# EAGLE board haasoscope_pro_fpga_board - power and fanout (EAGLE 9.6.2)
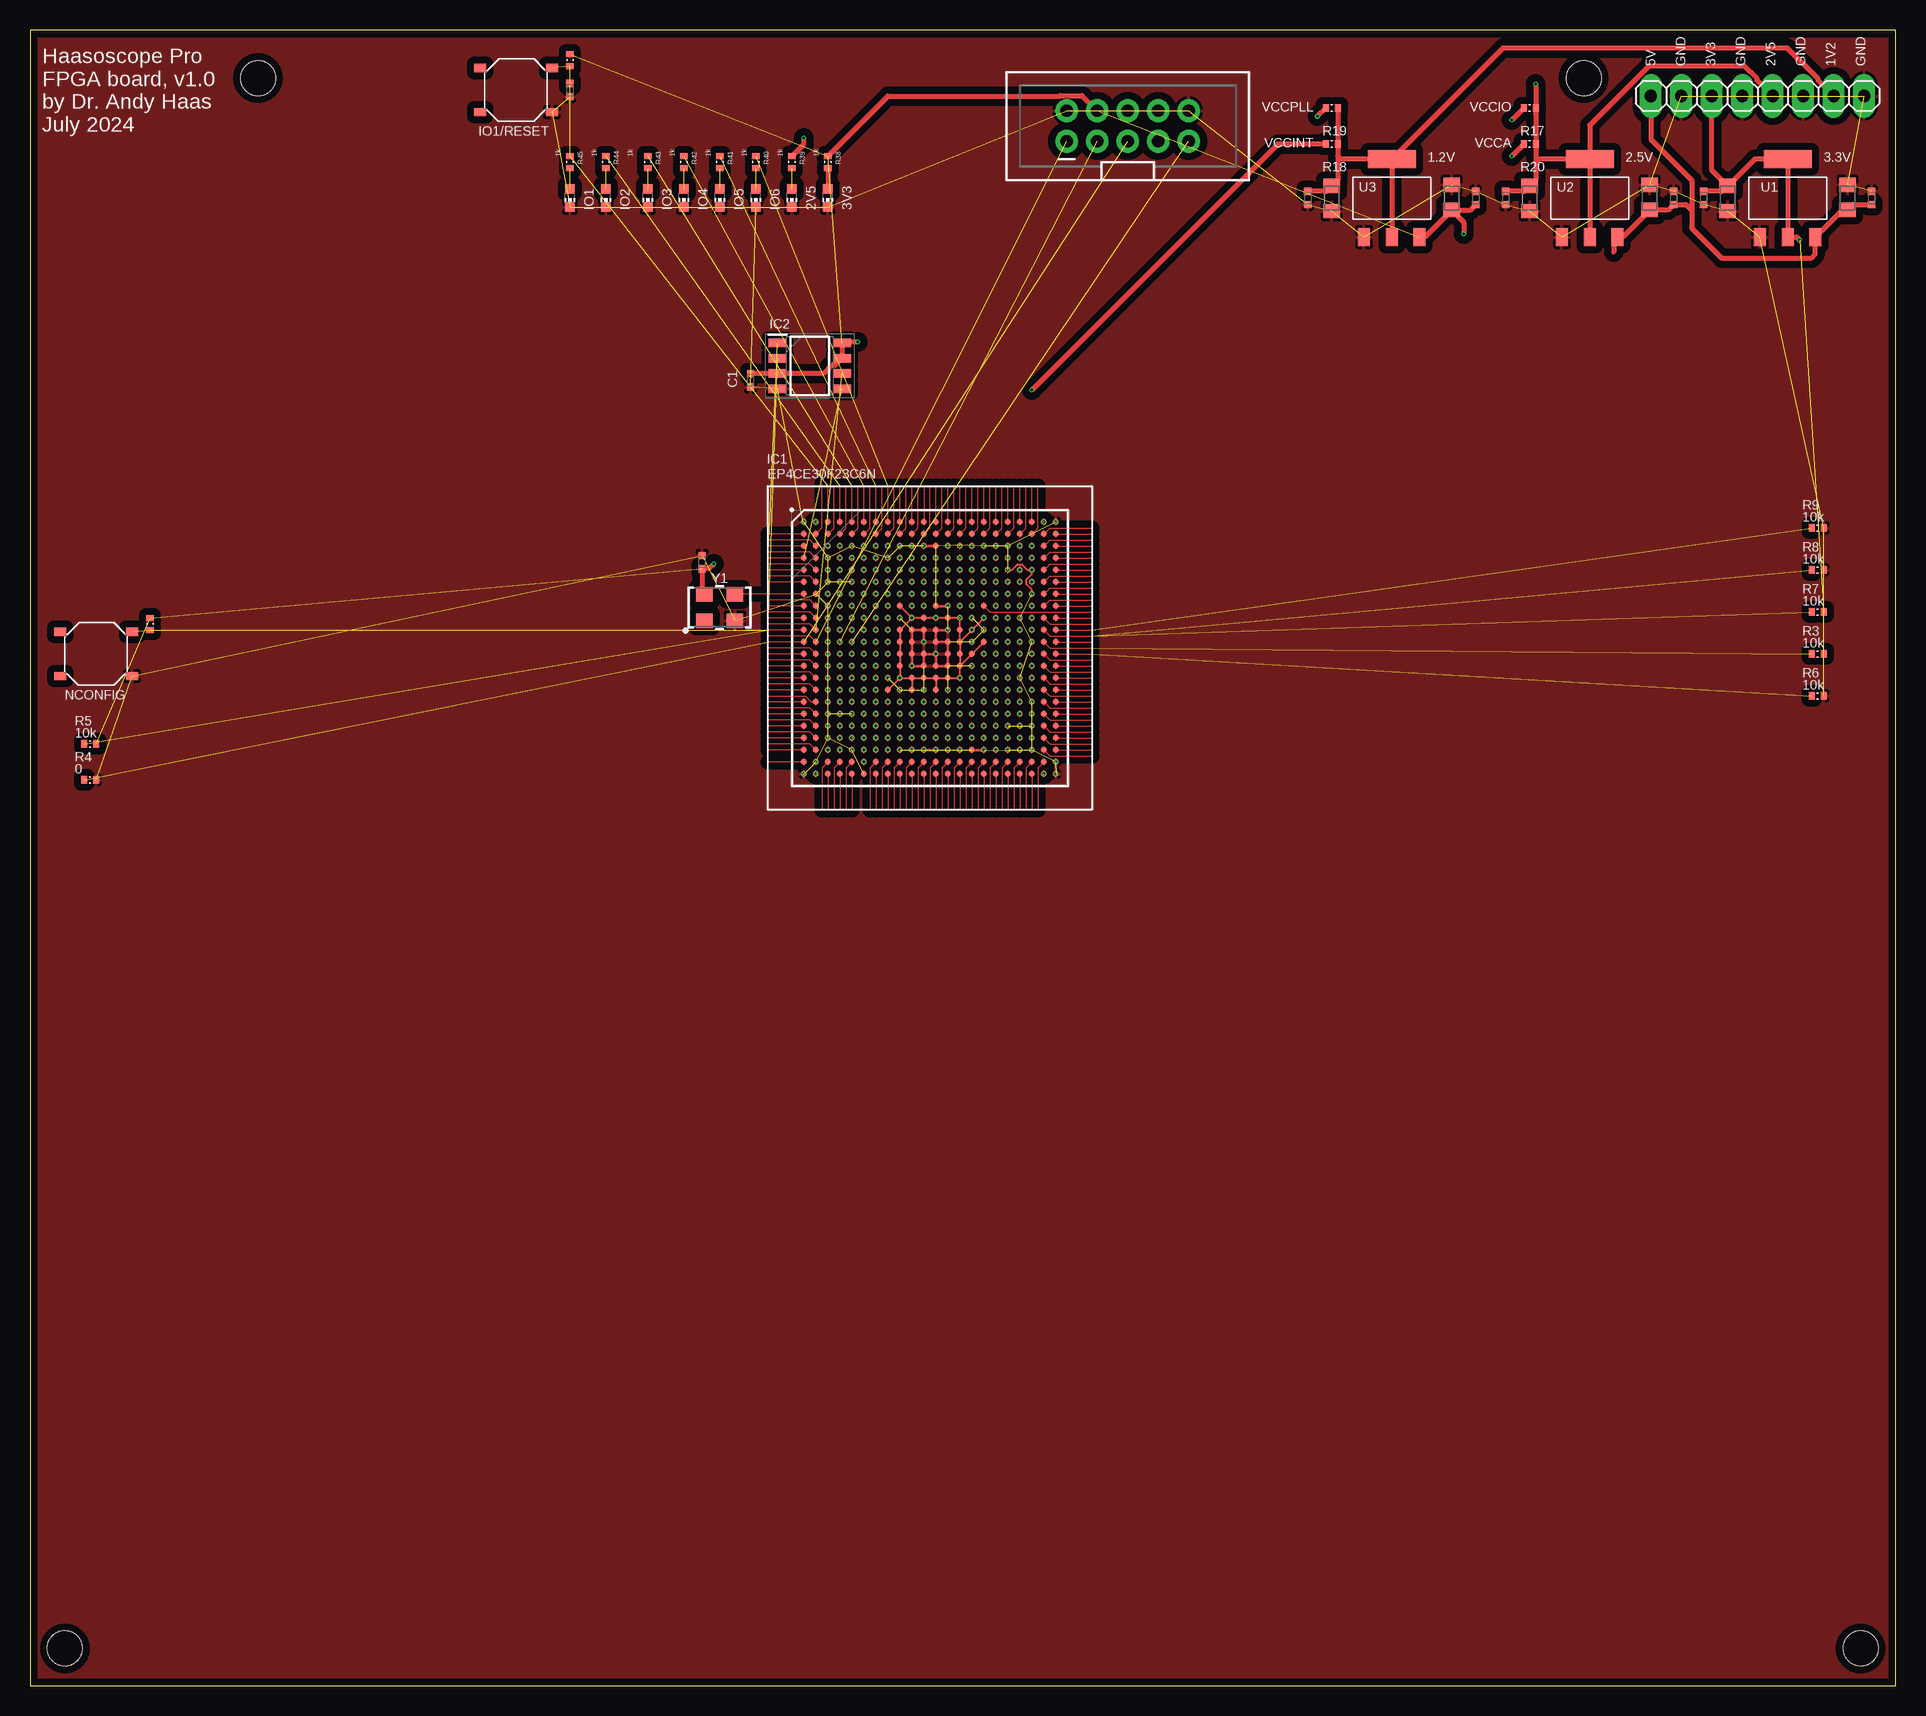
[diagram p4: board, top side]
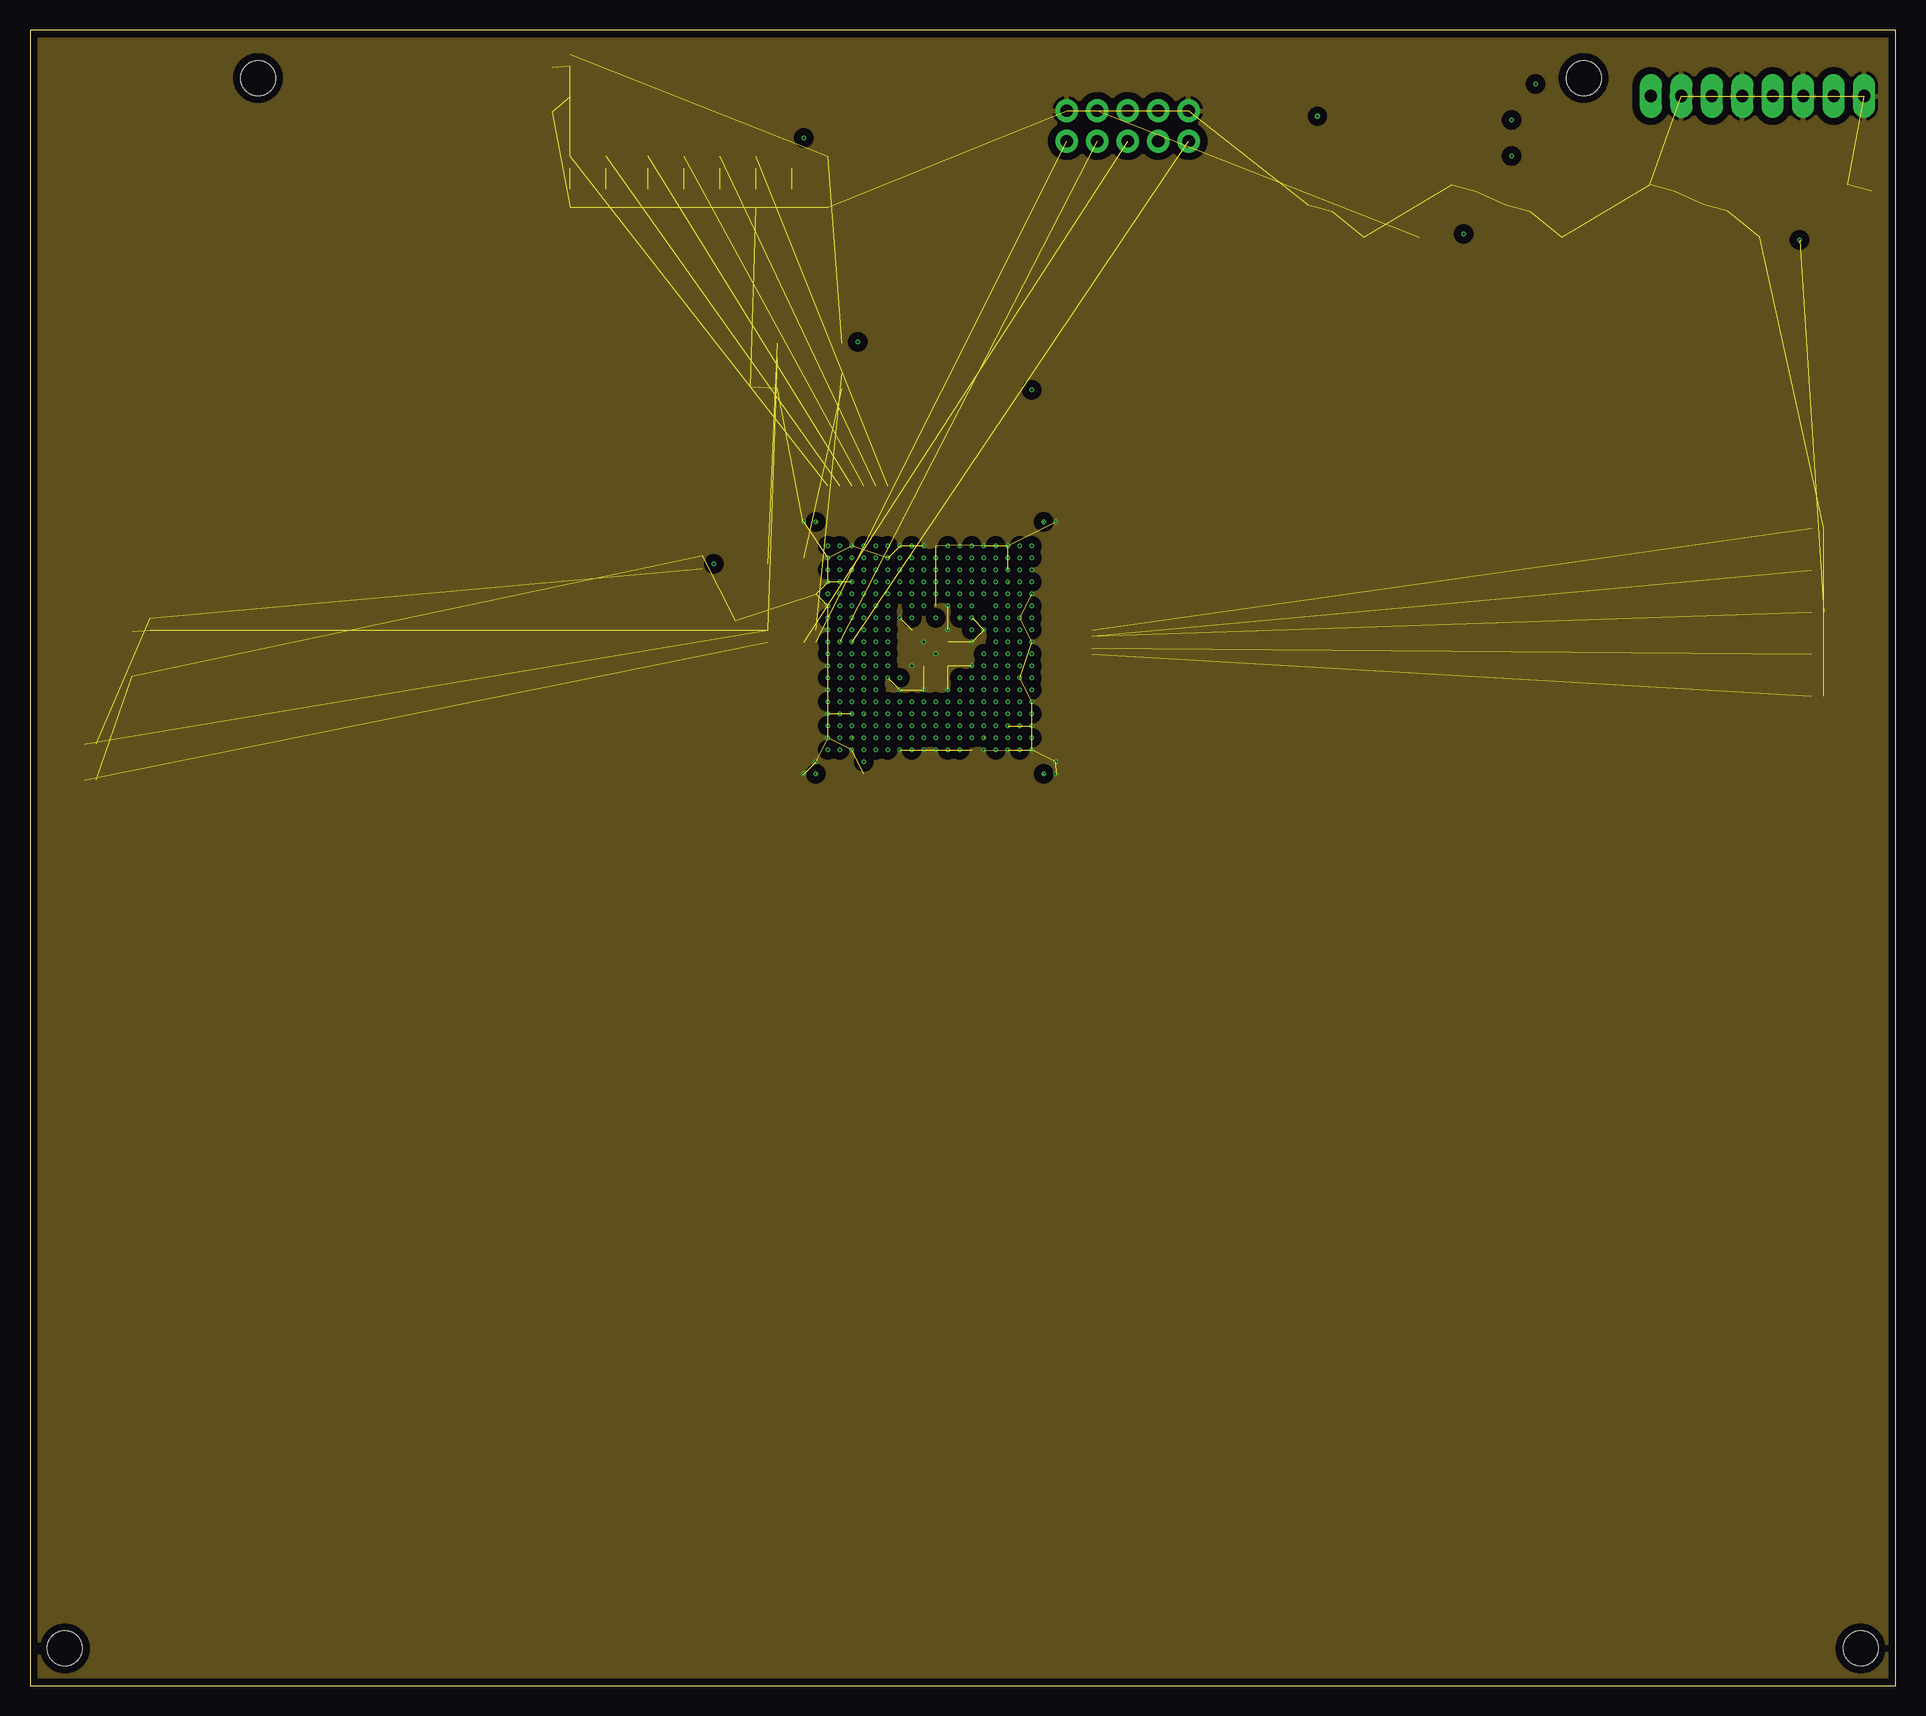
[diagram p5: board, inner layer topgnd]
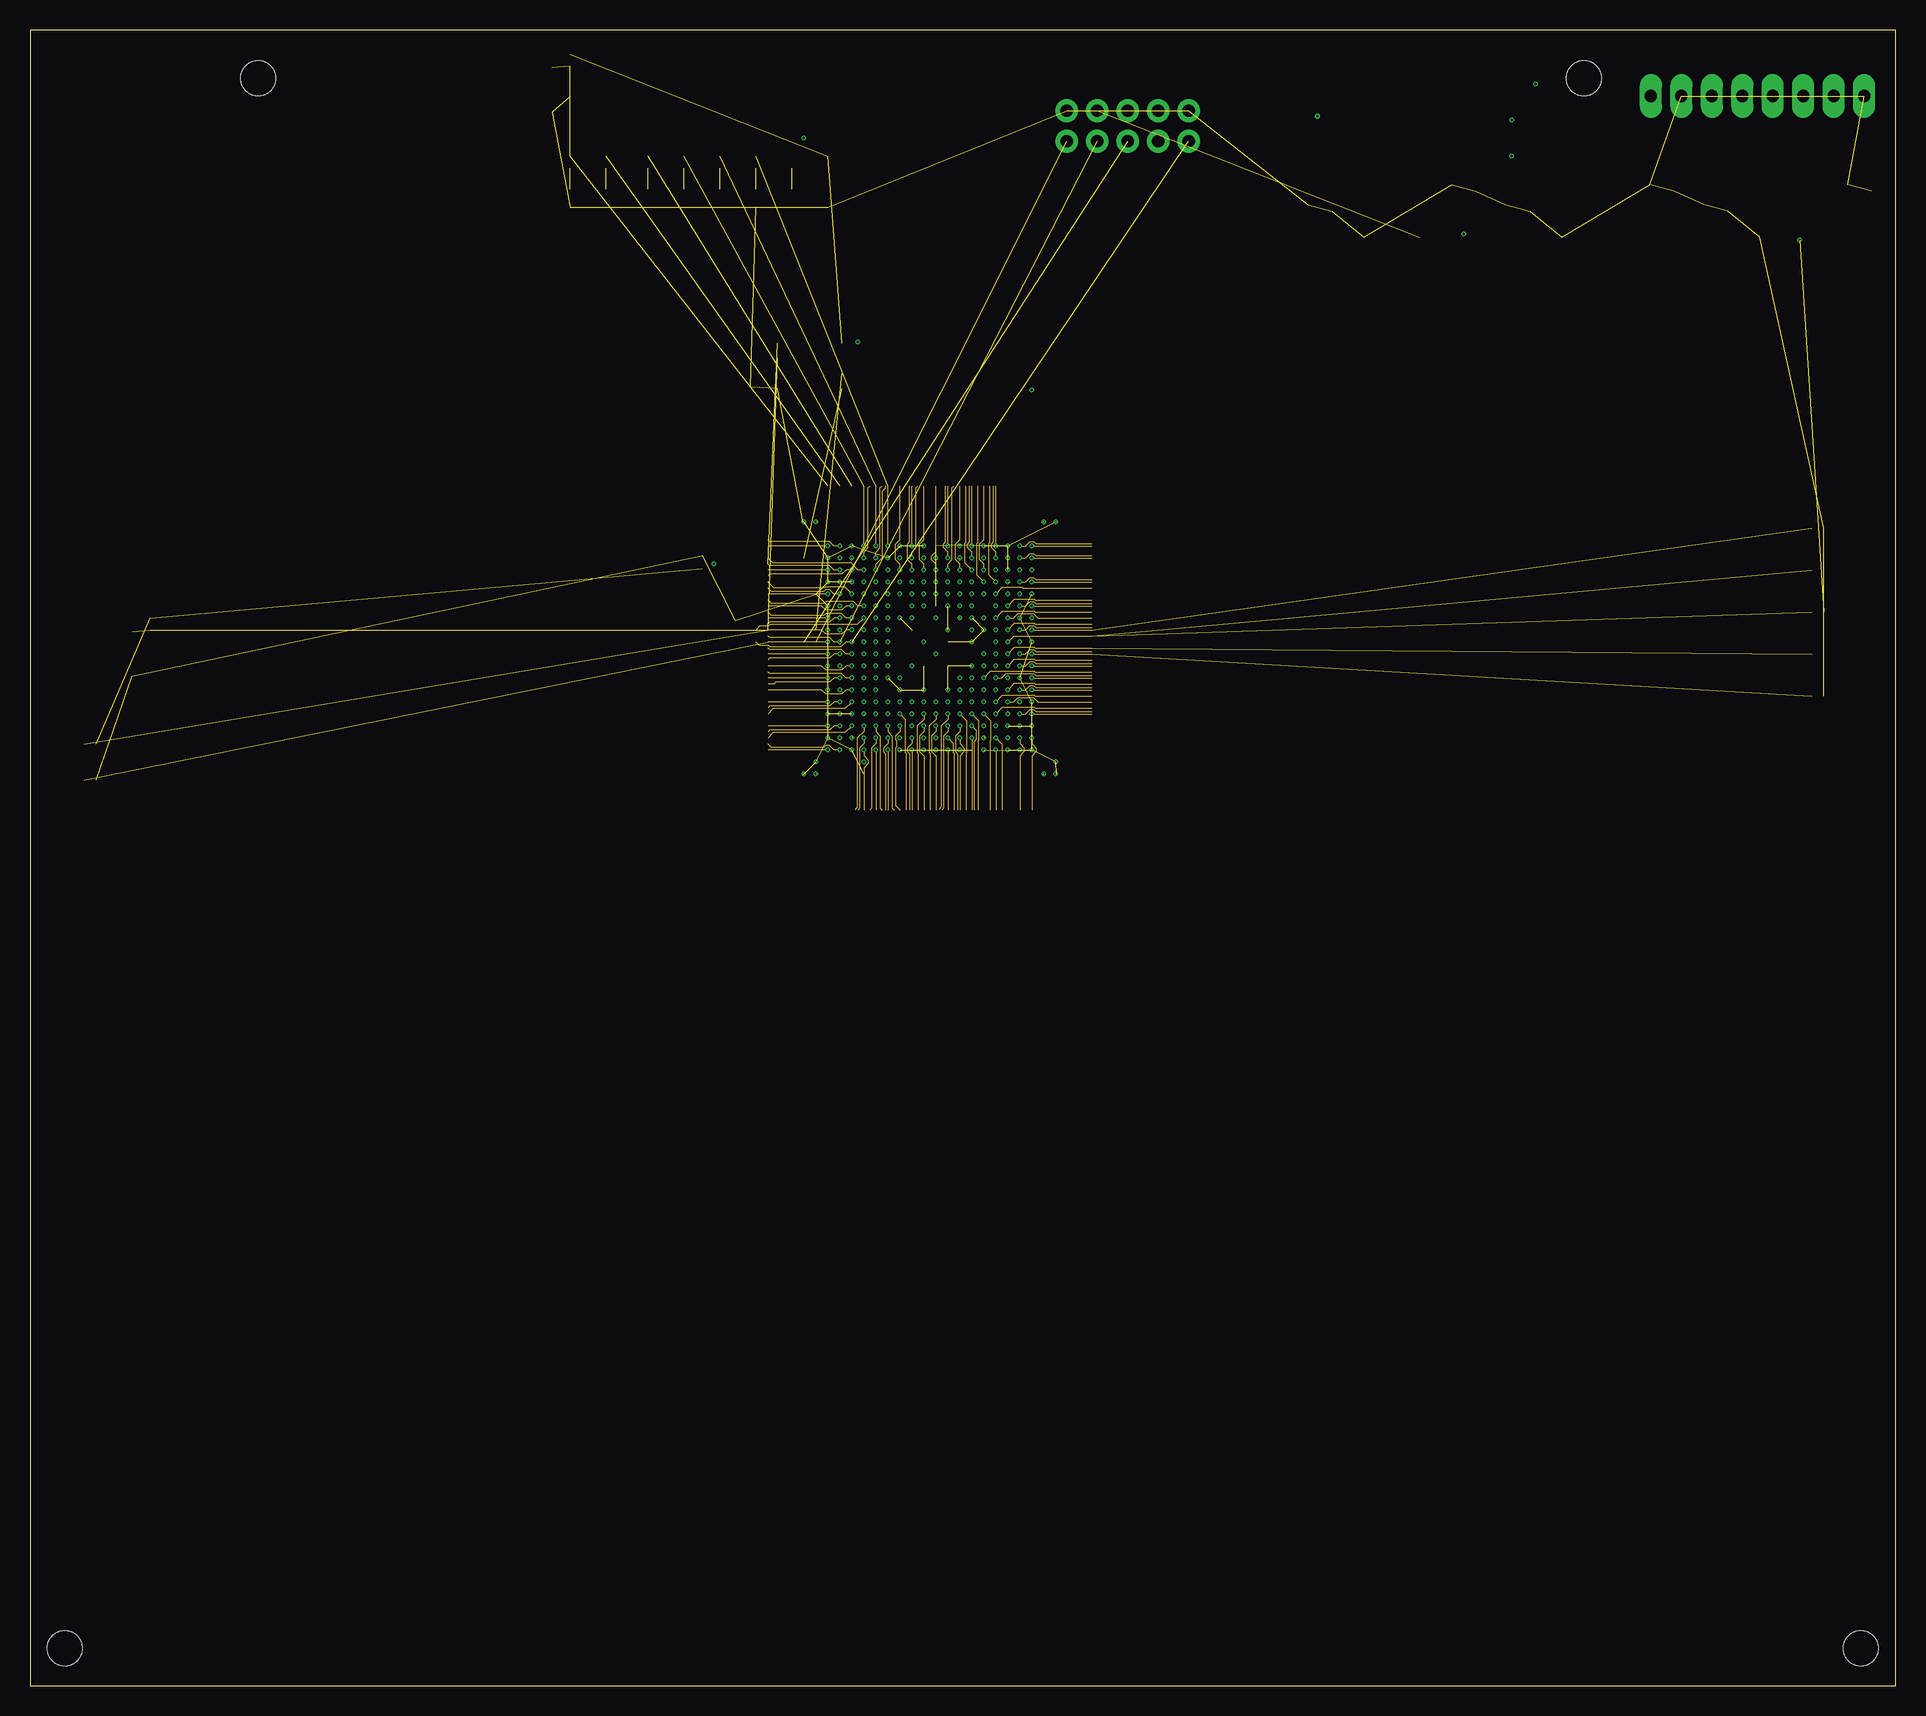
[diagram p6: board, inner layer sig2]
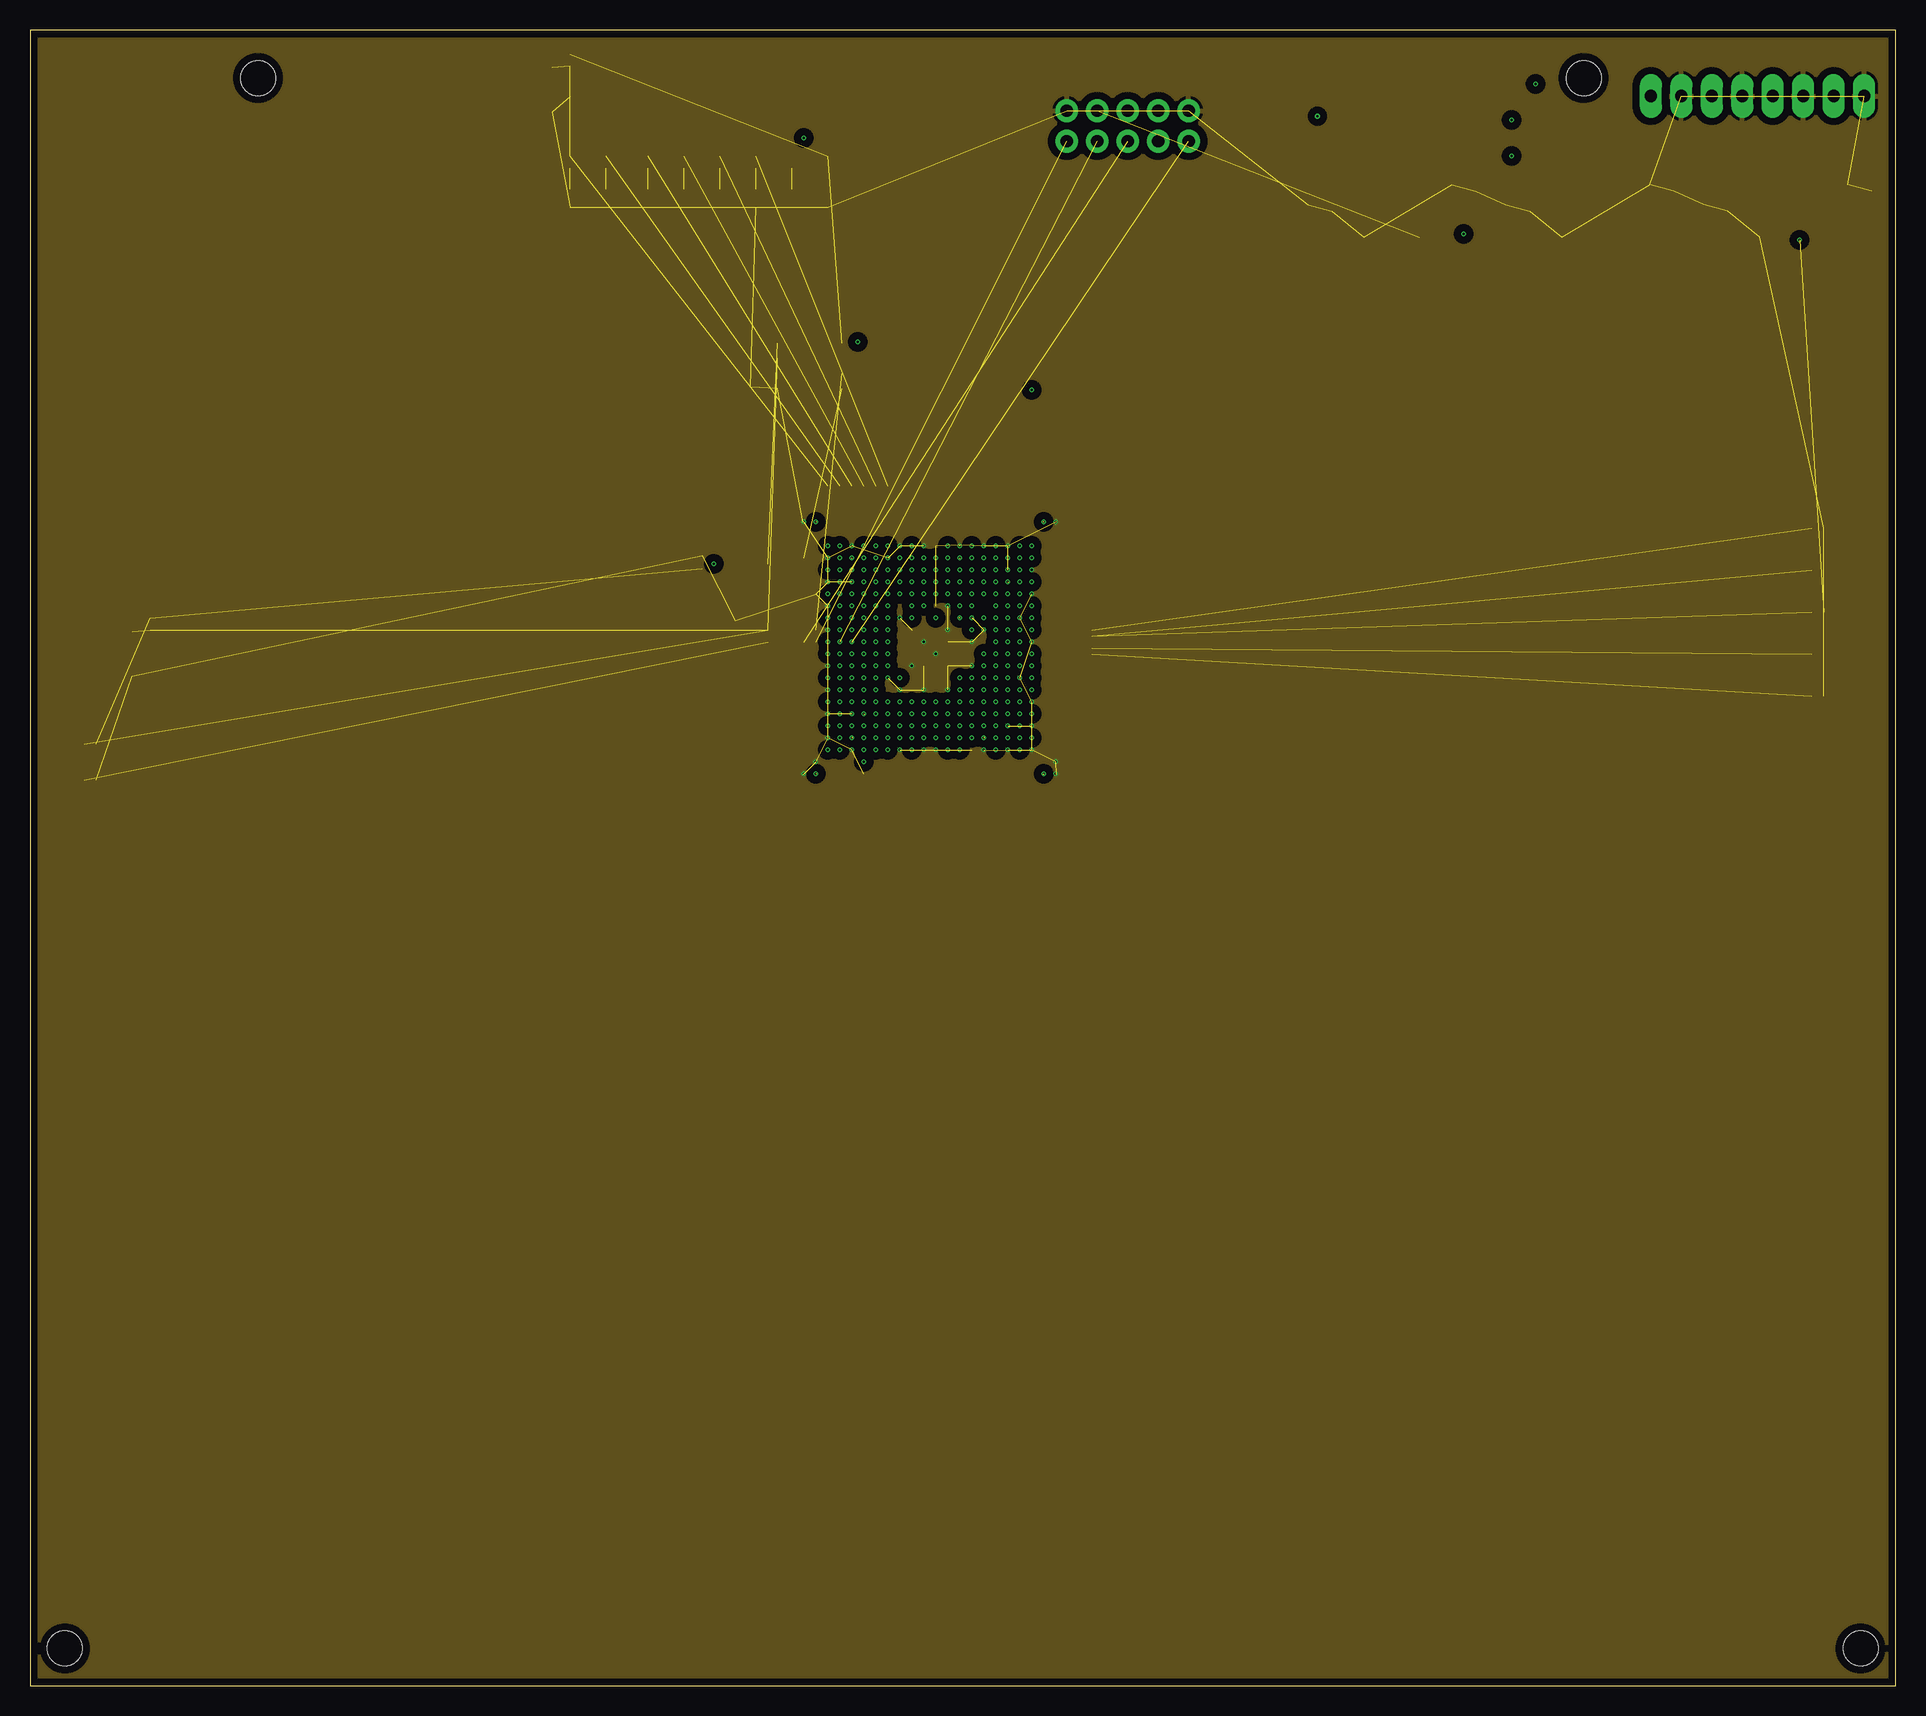
[diagram p7: board, inner layer sig2gnd]
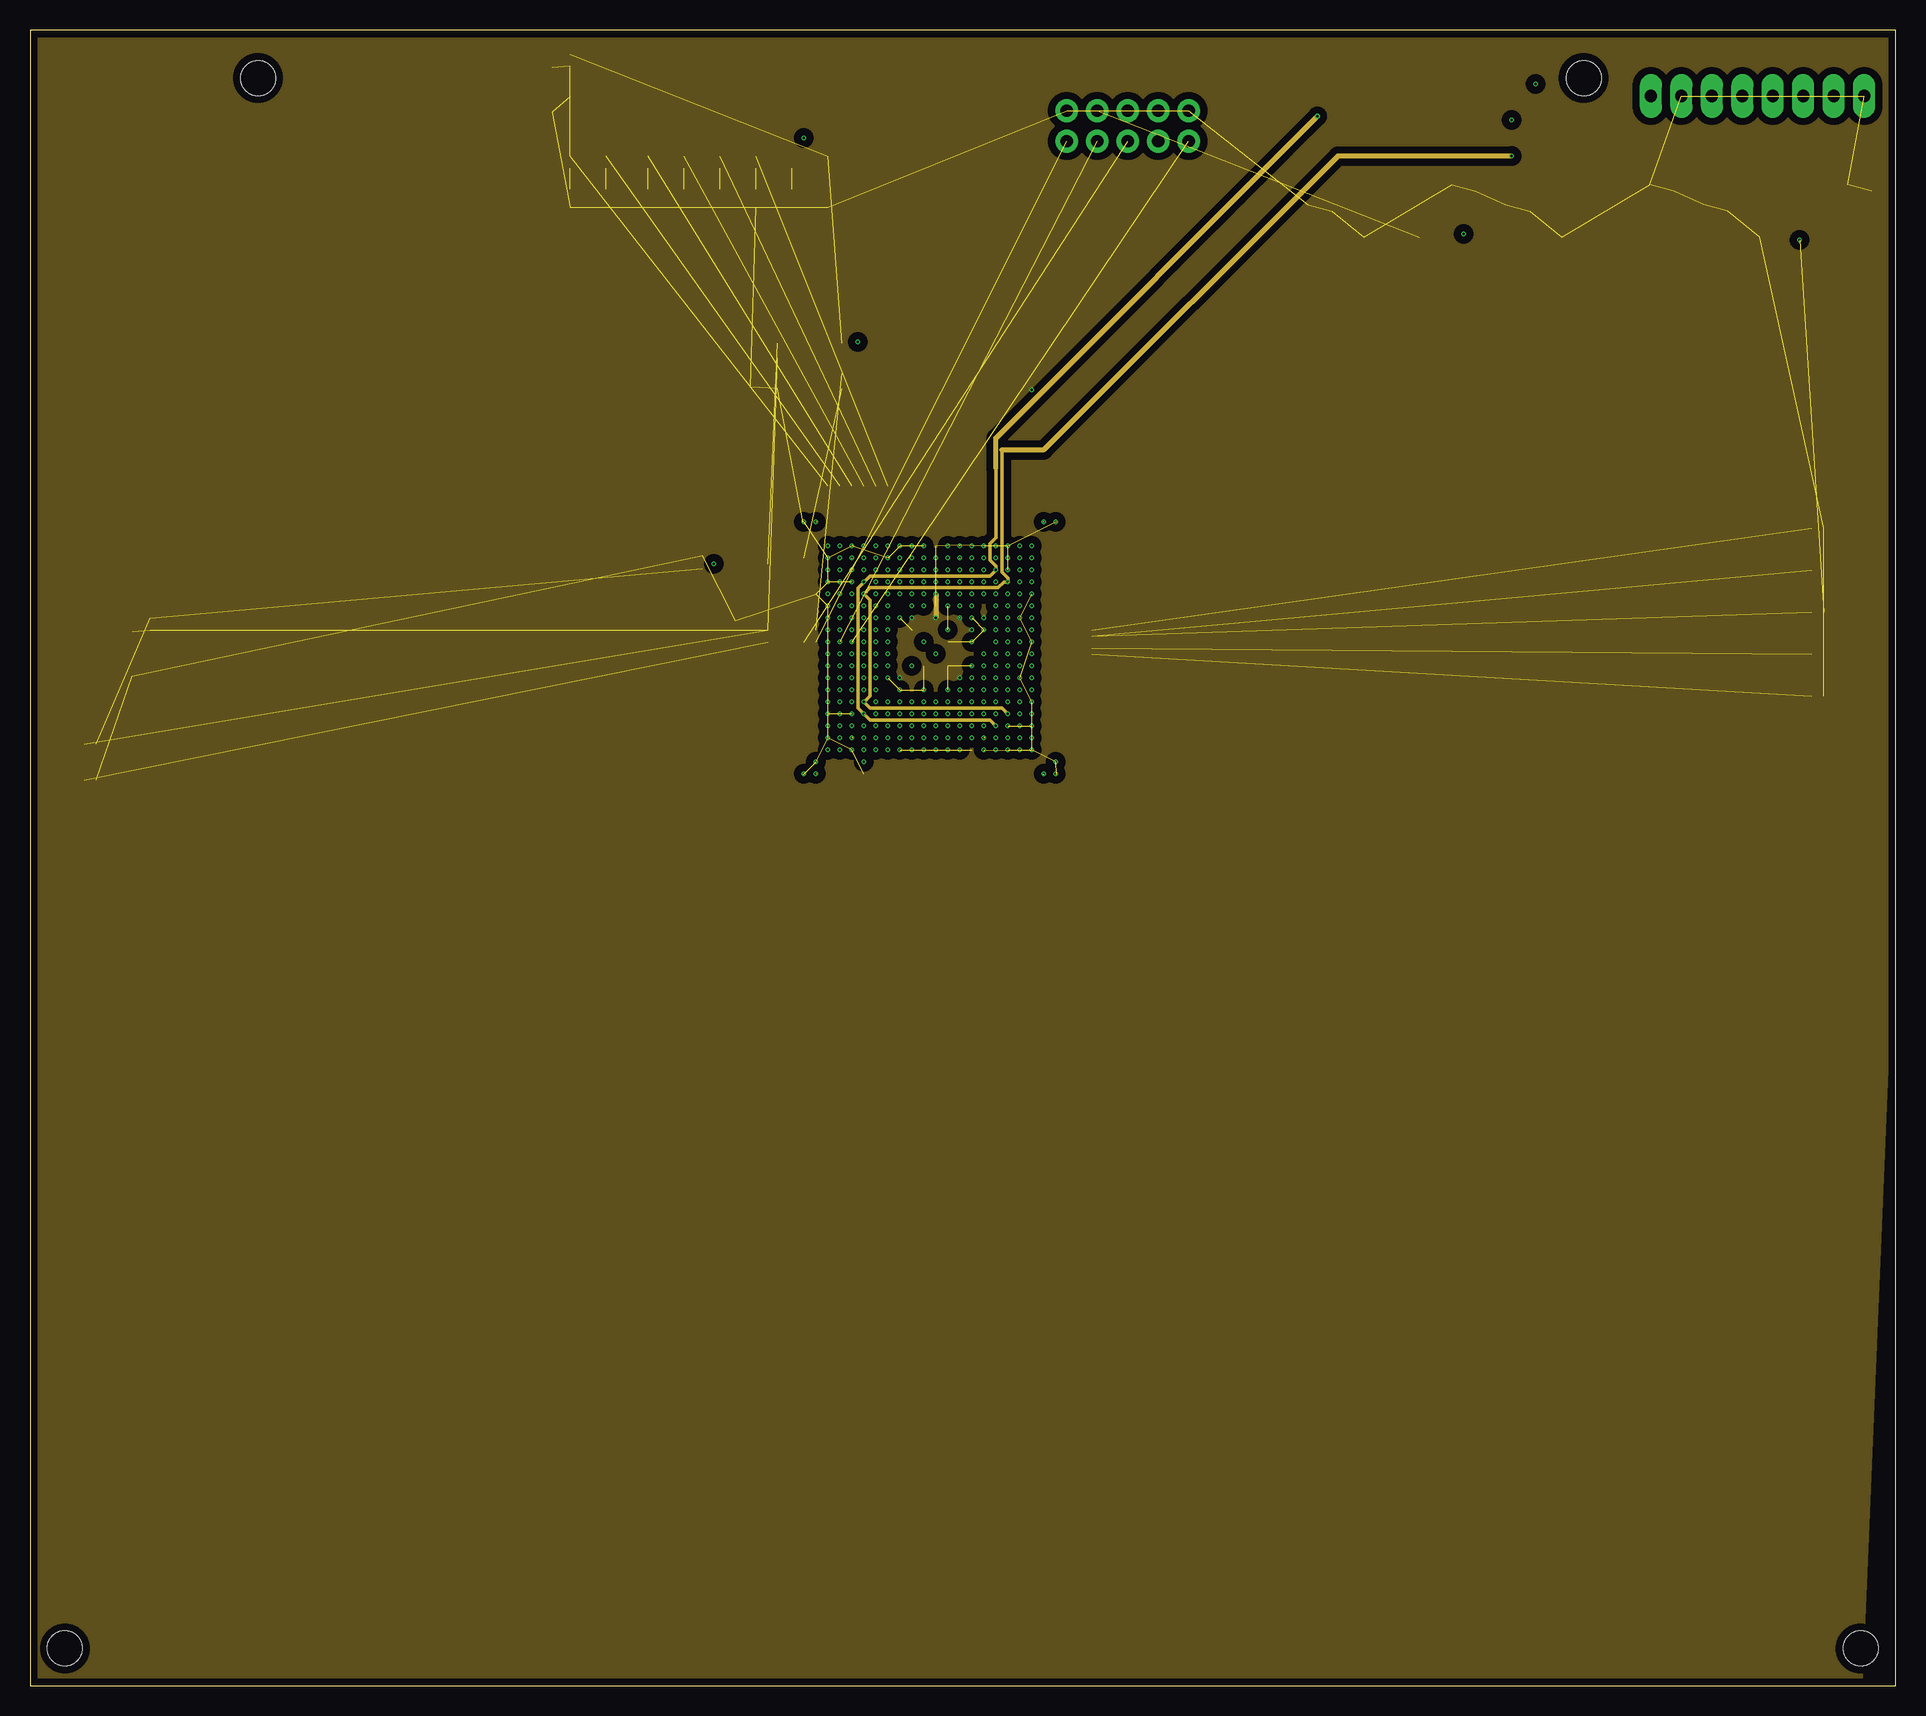
[diagram p8: board, inner layer pow1]
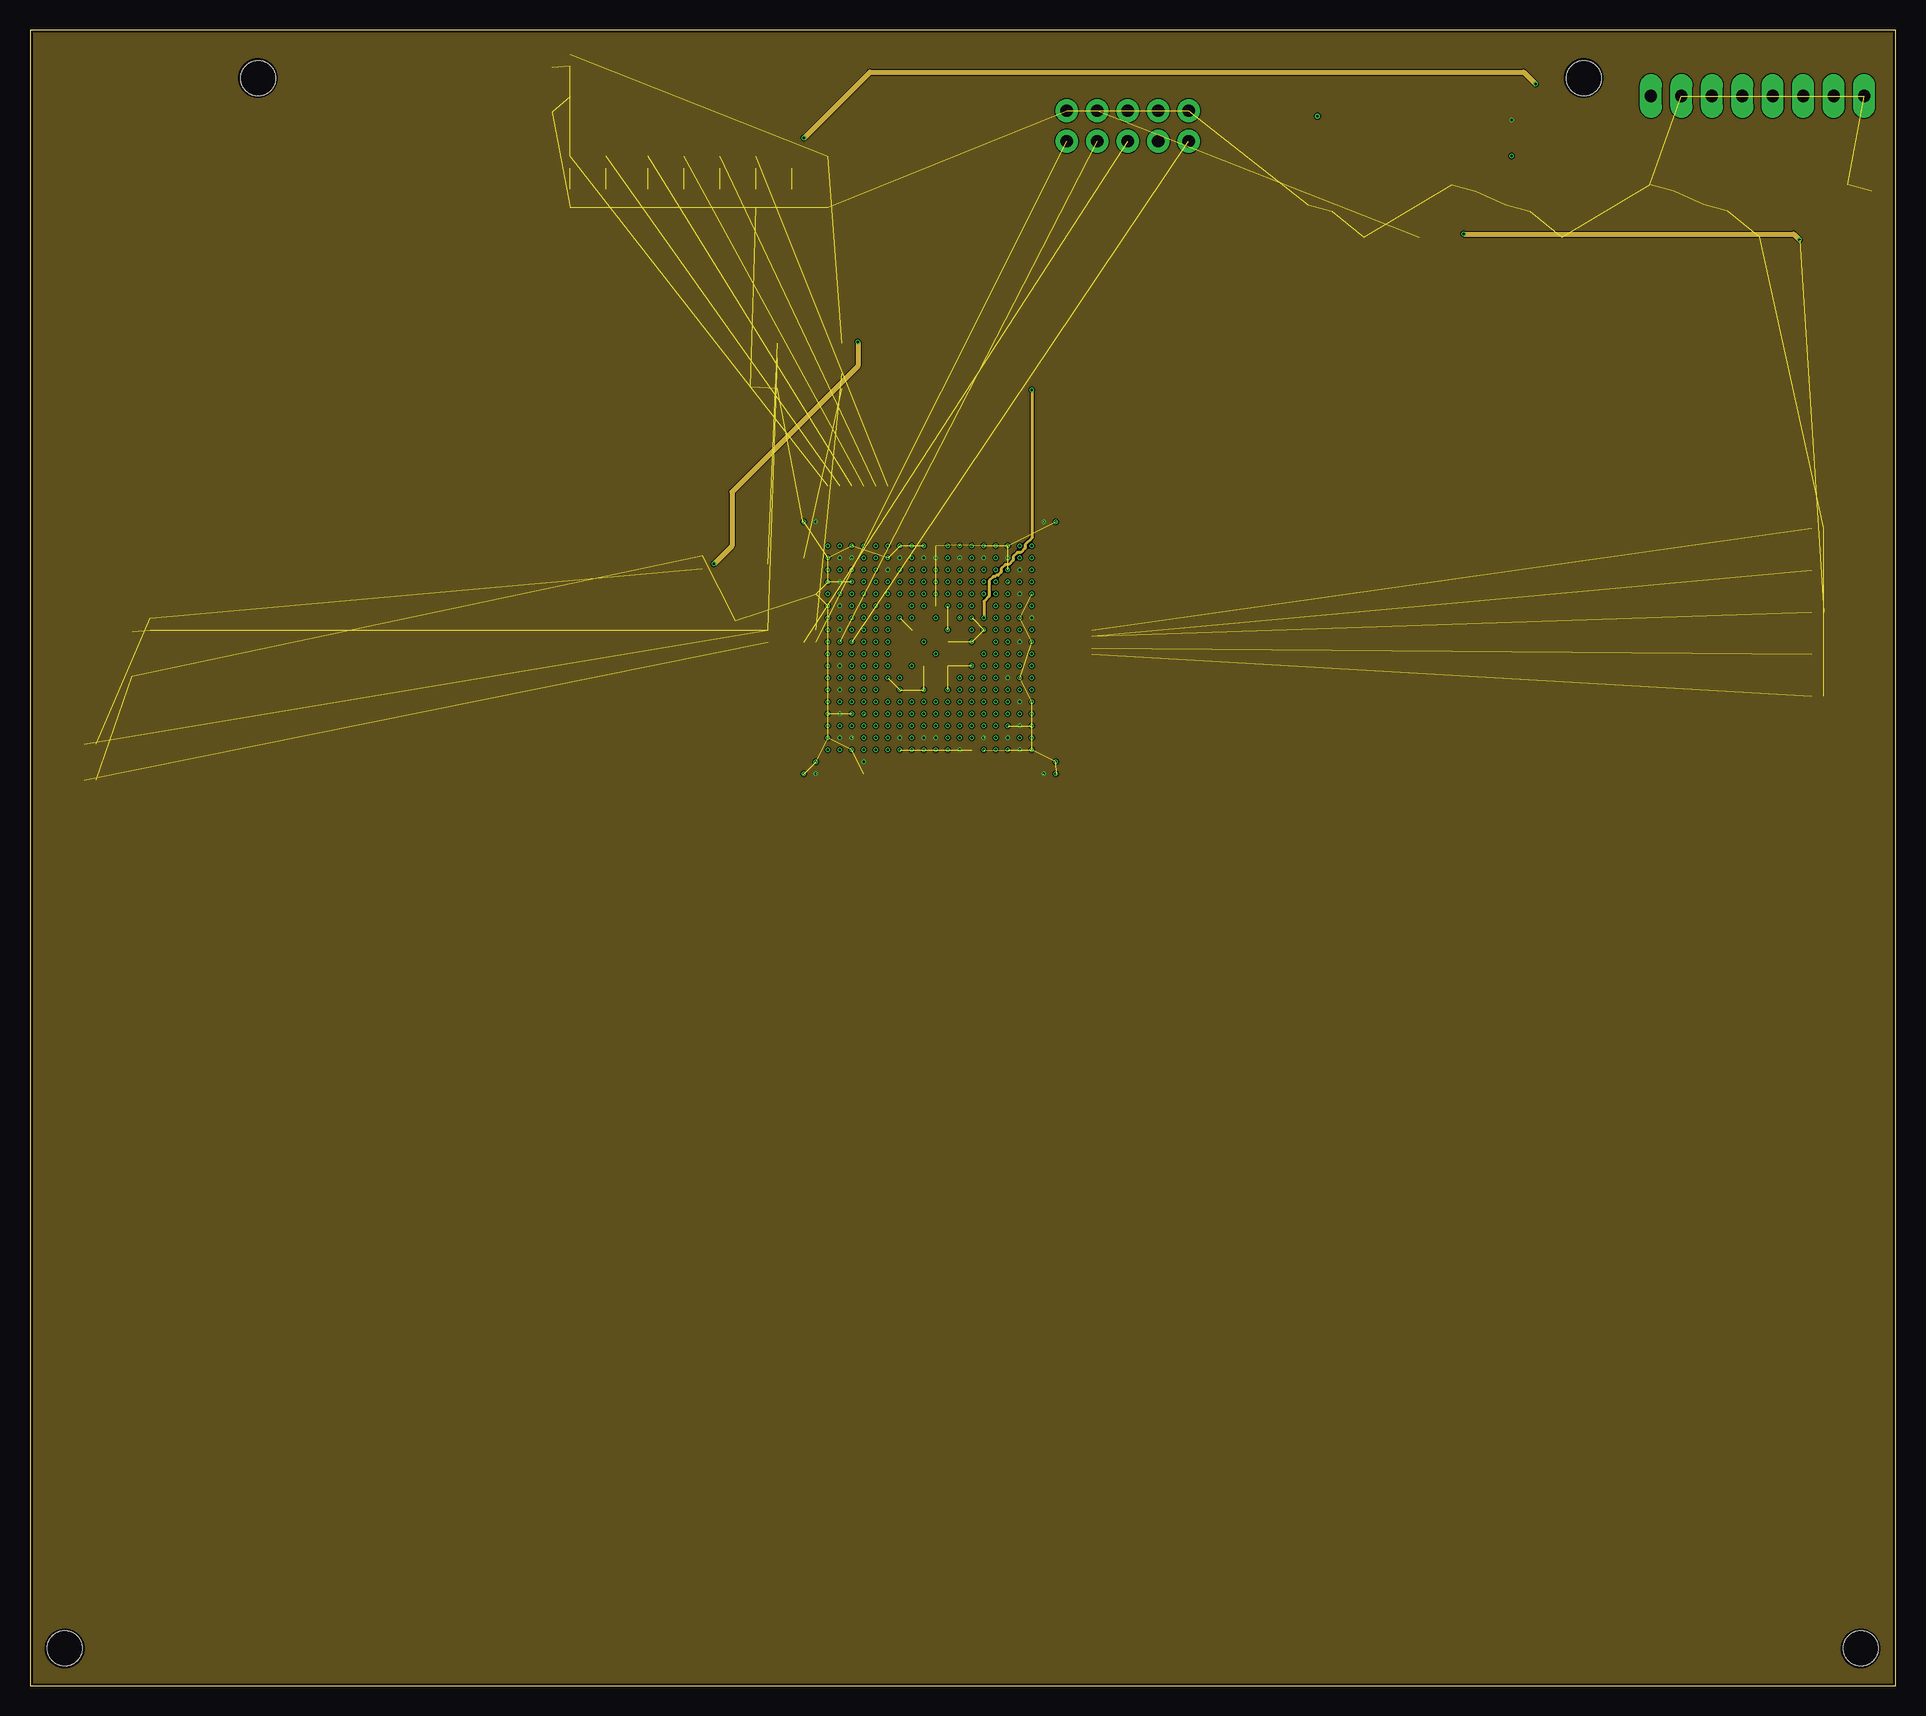
[diagram p9: board, inner layer pow2]
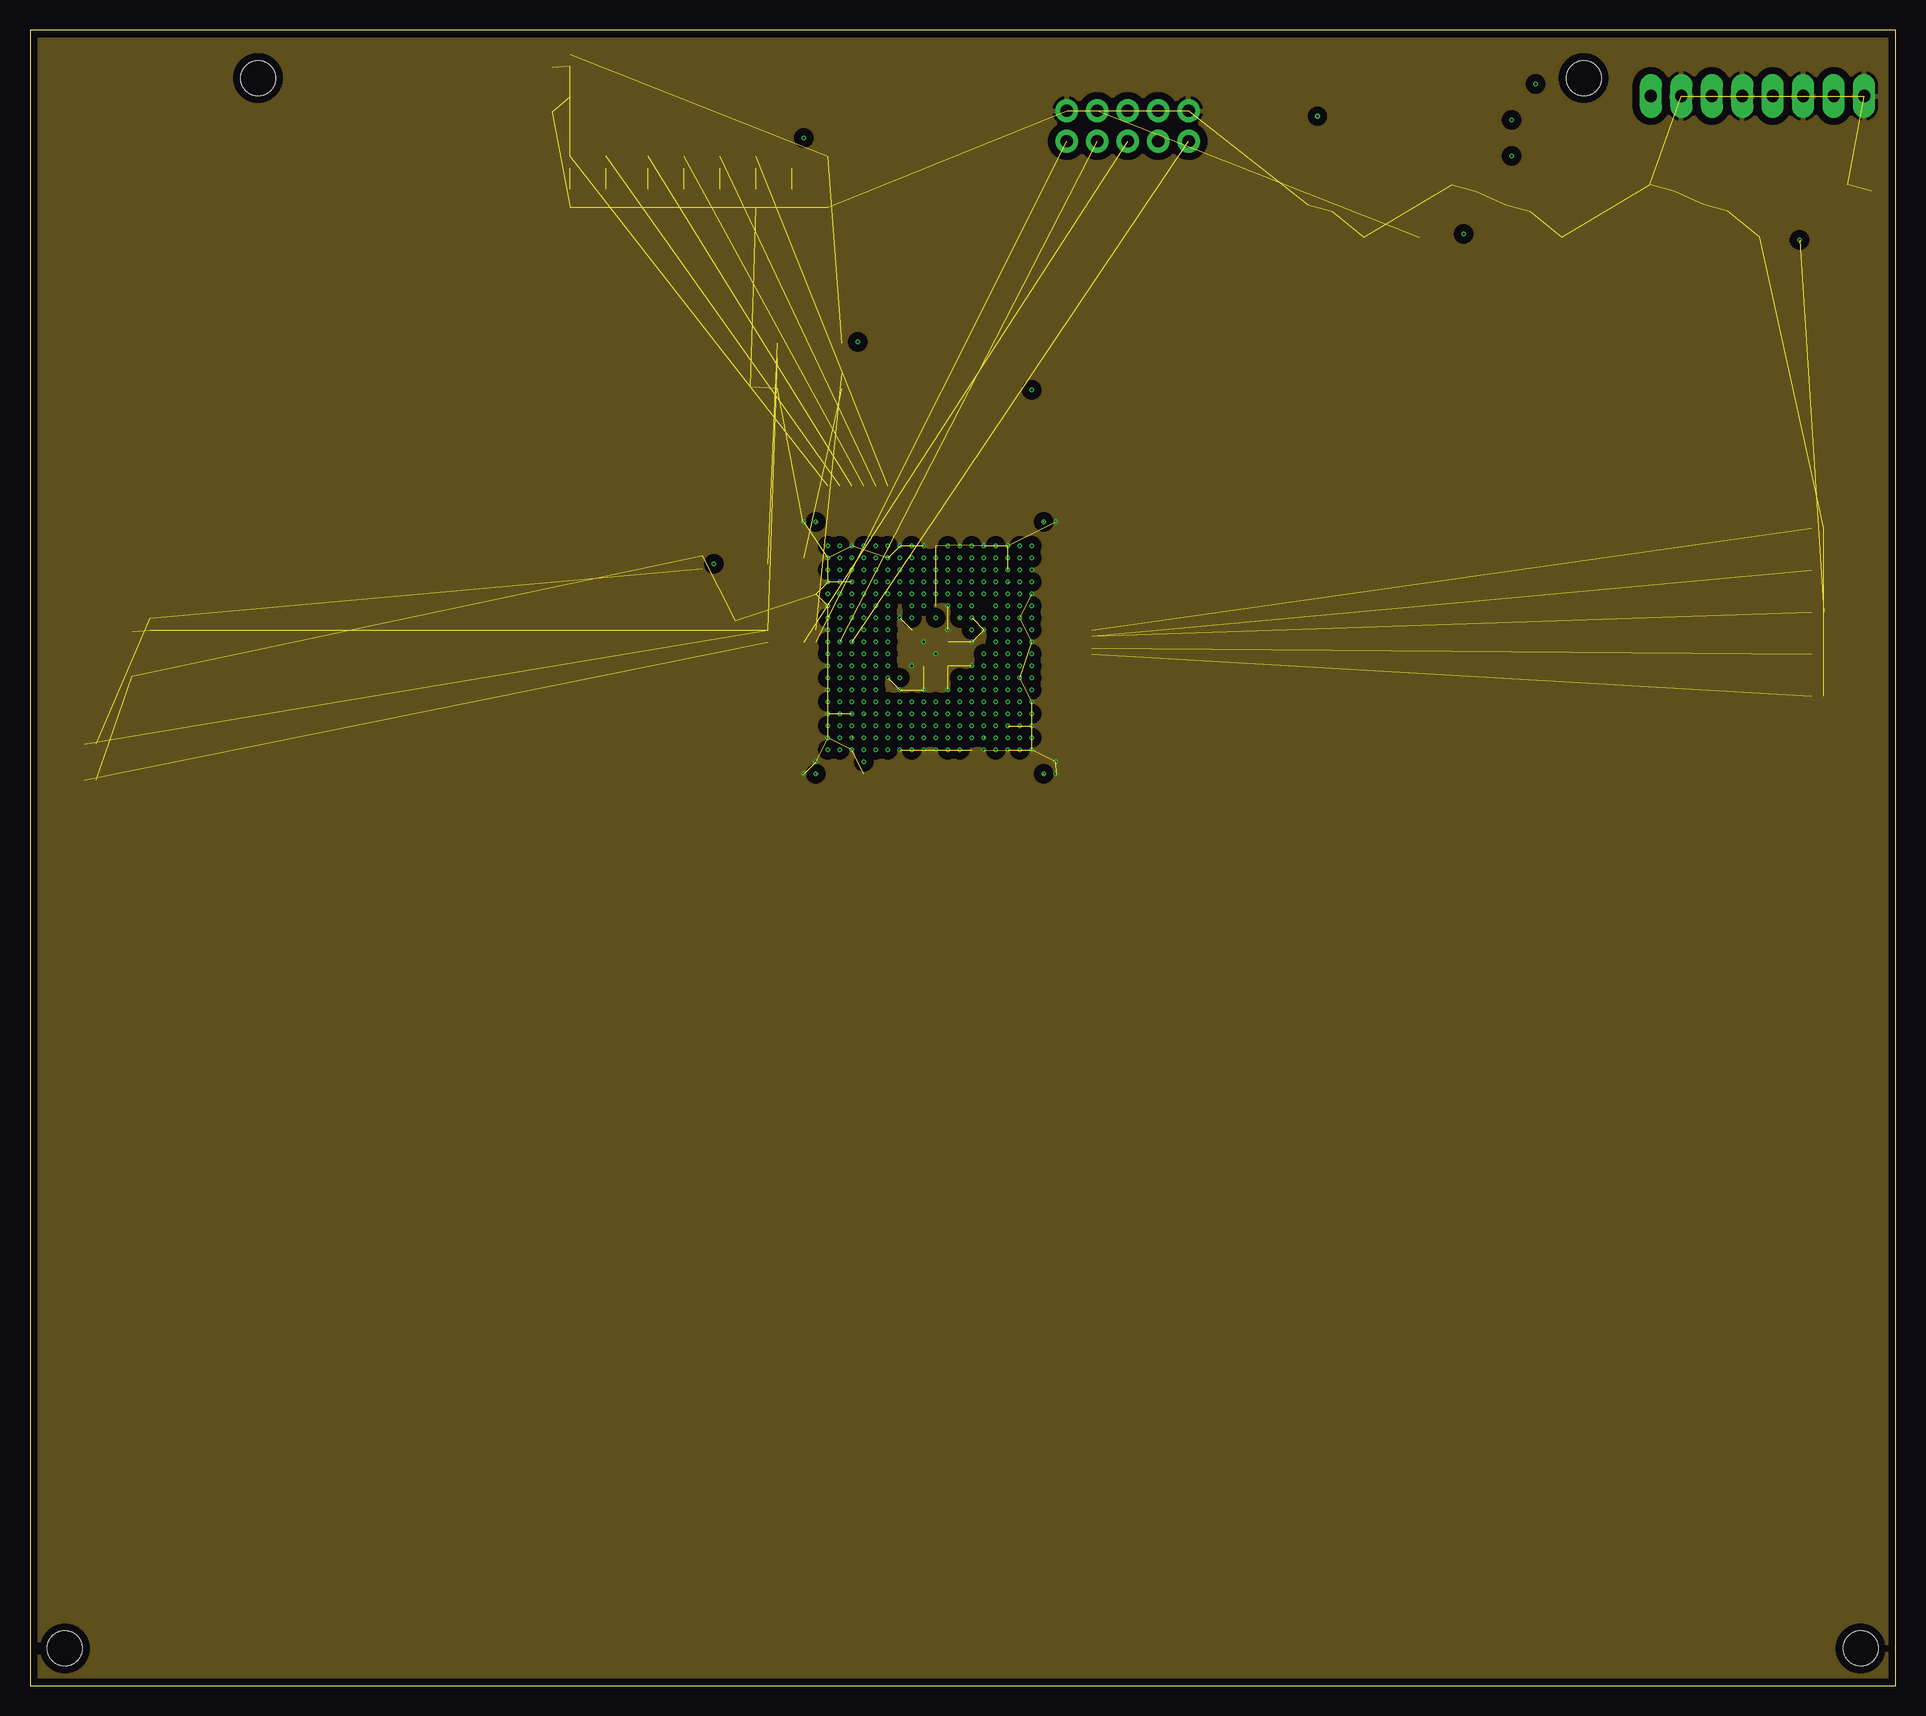
[diagram p10: board, inner layer sig4gnd]
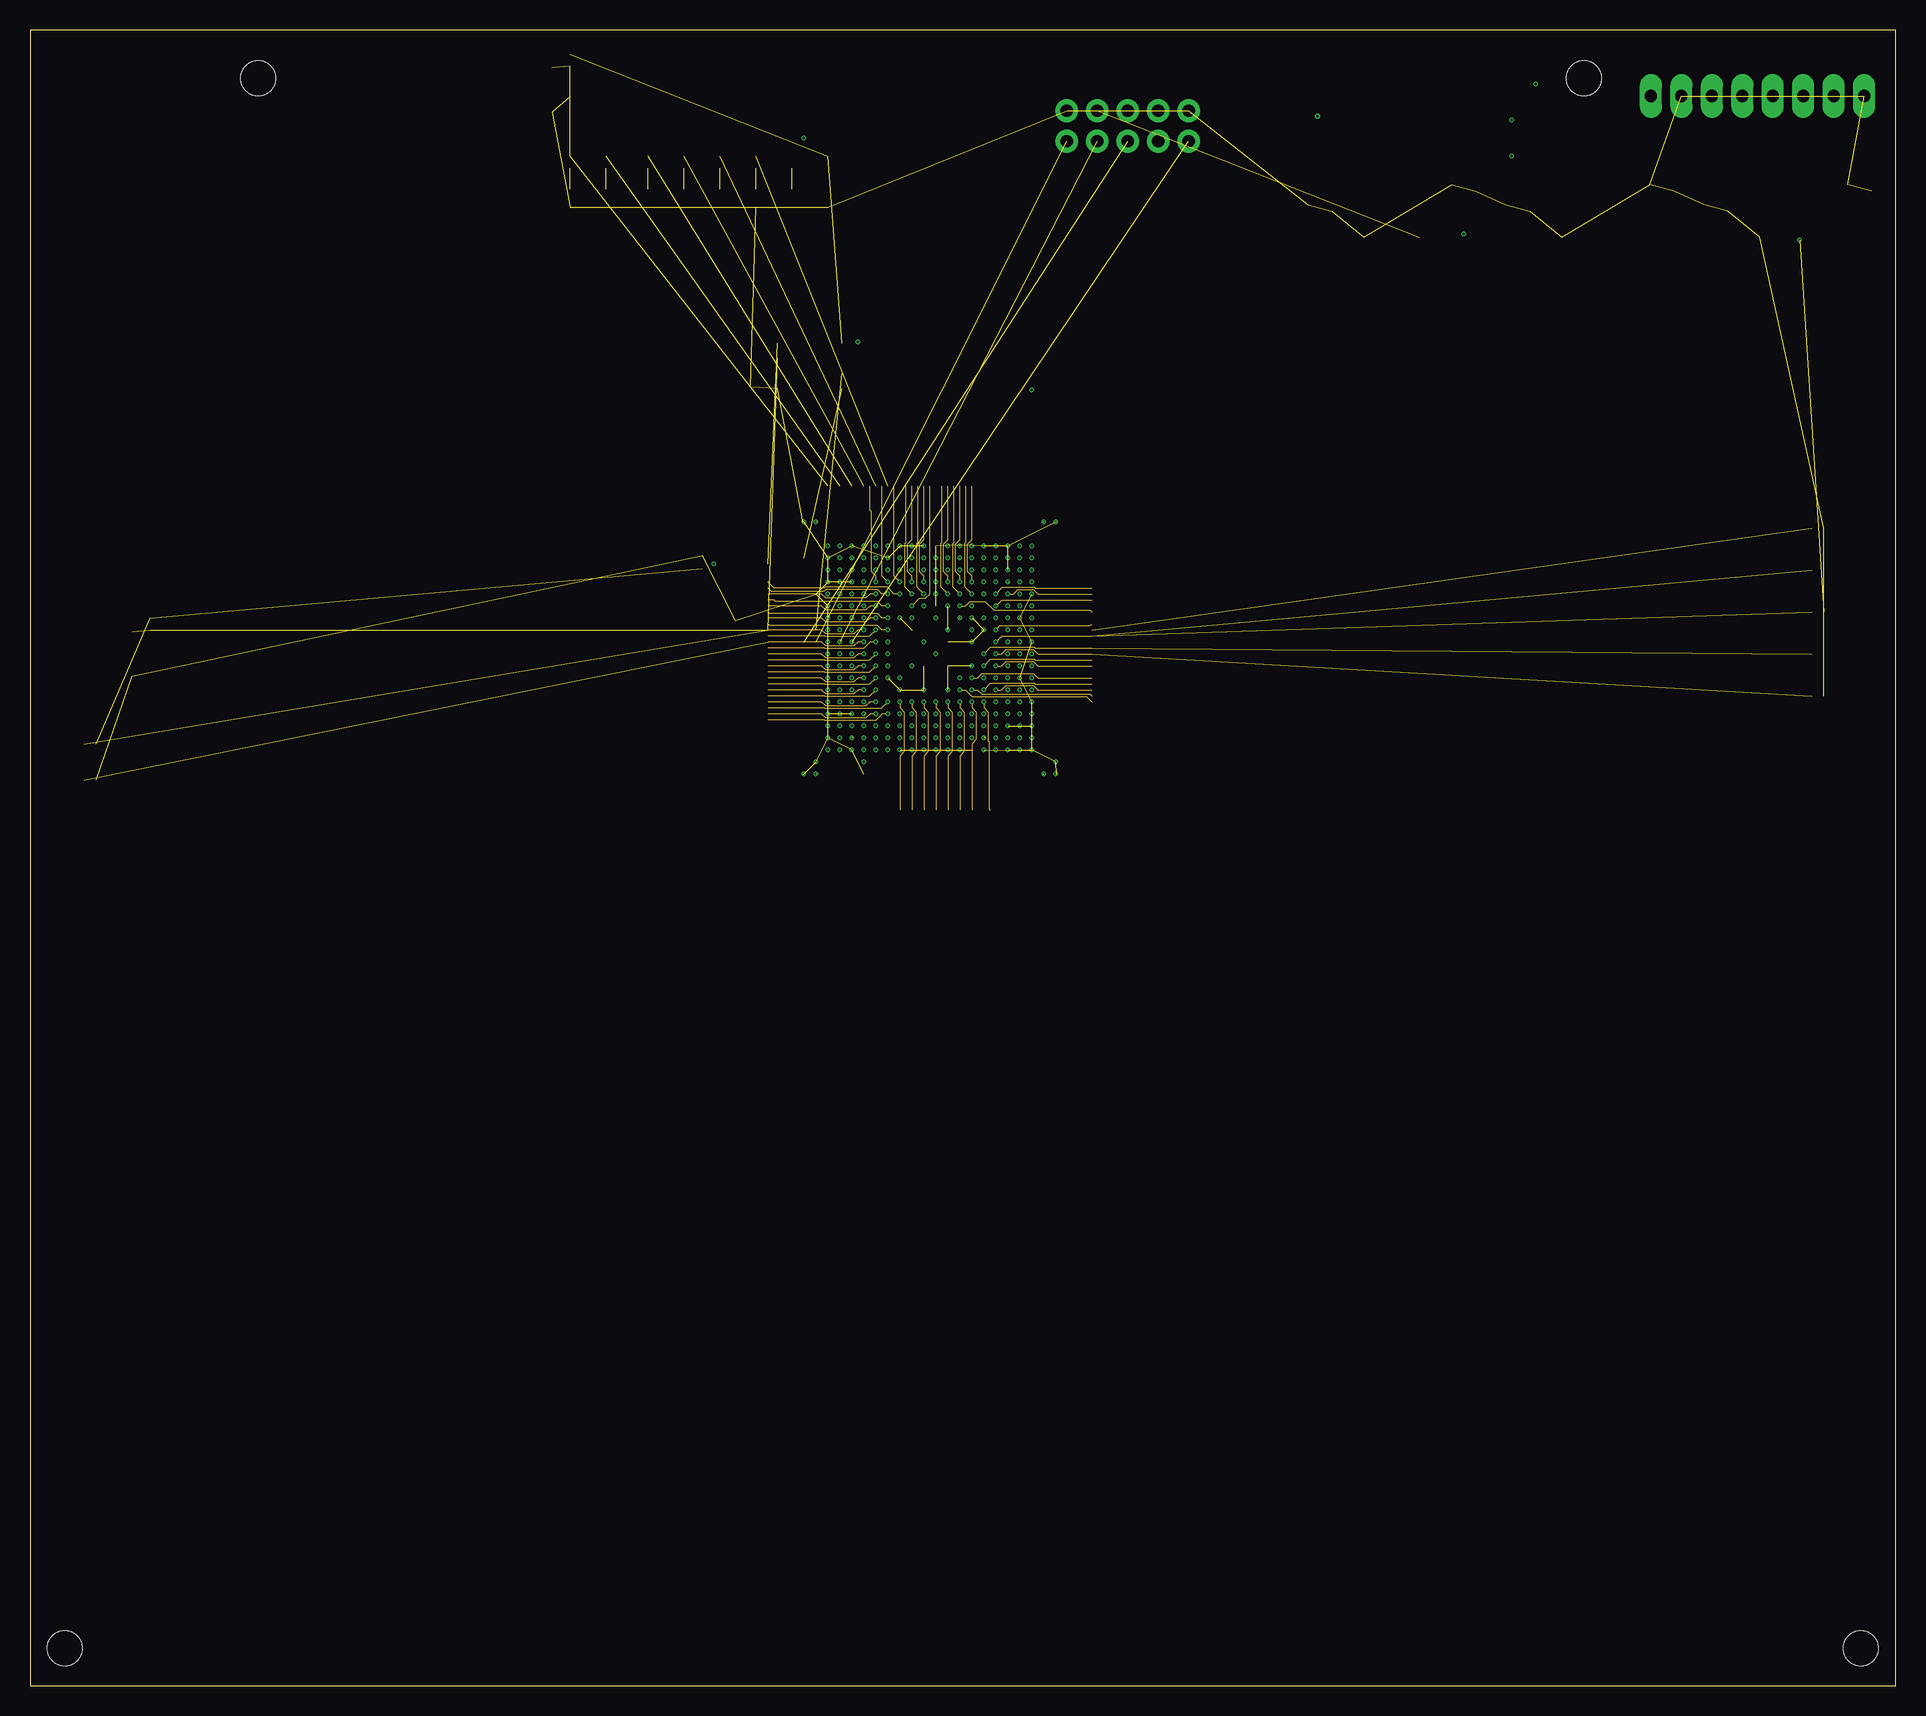
[diagram p11: board, inner layer sig4]
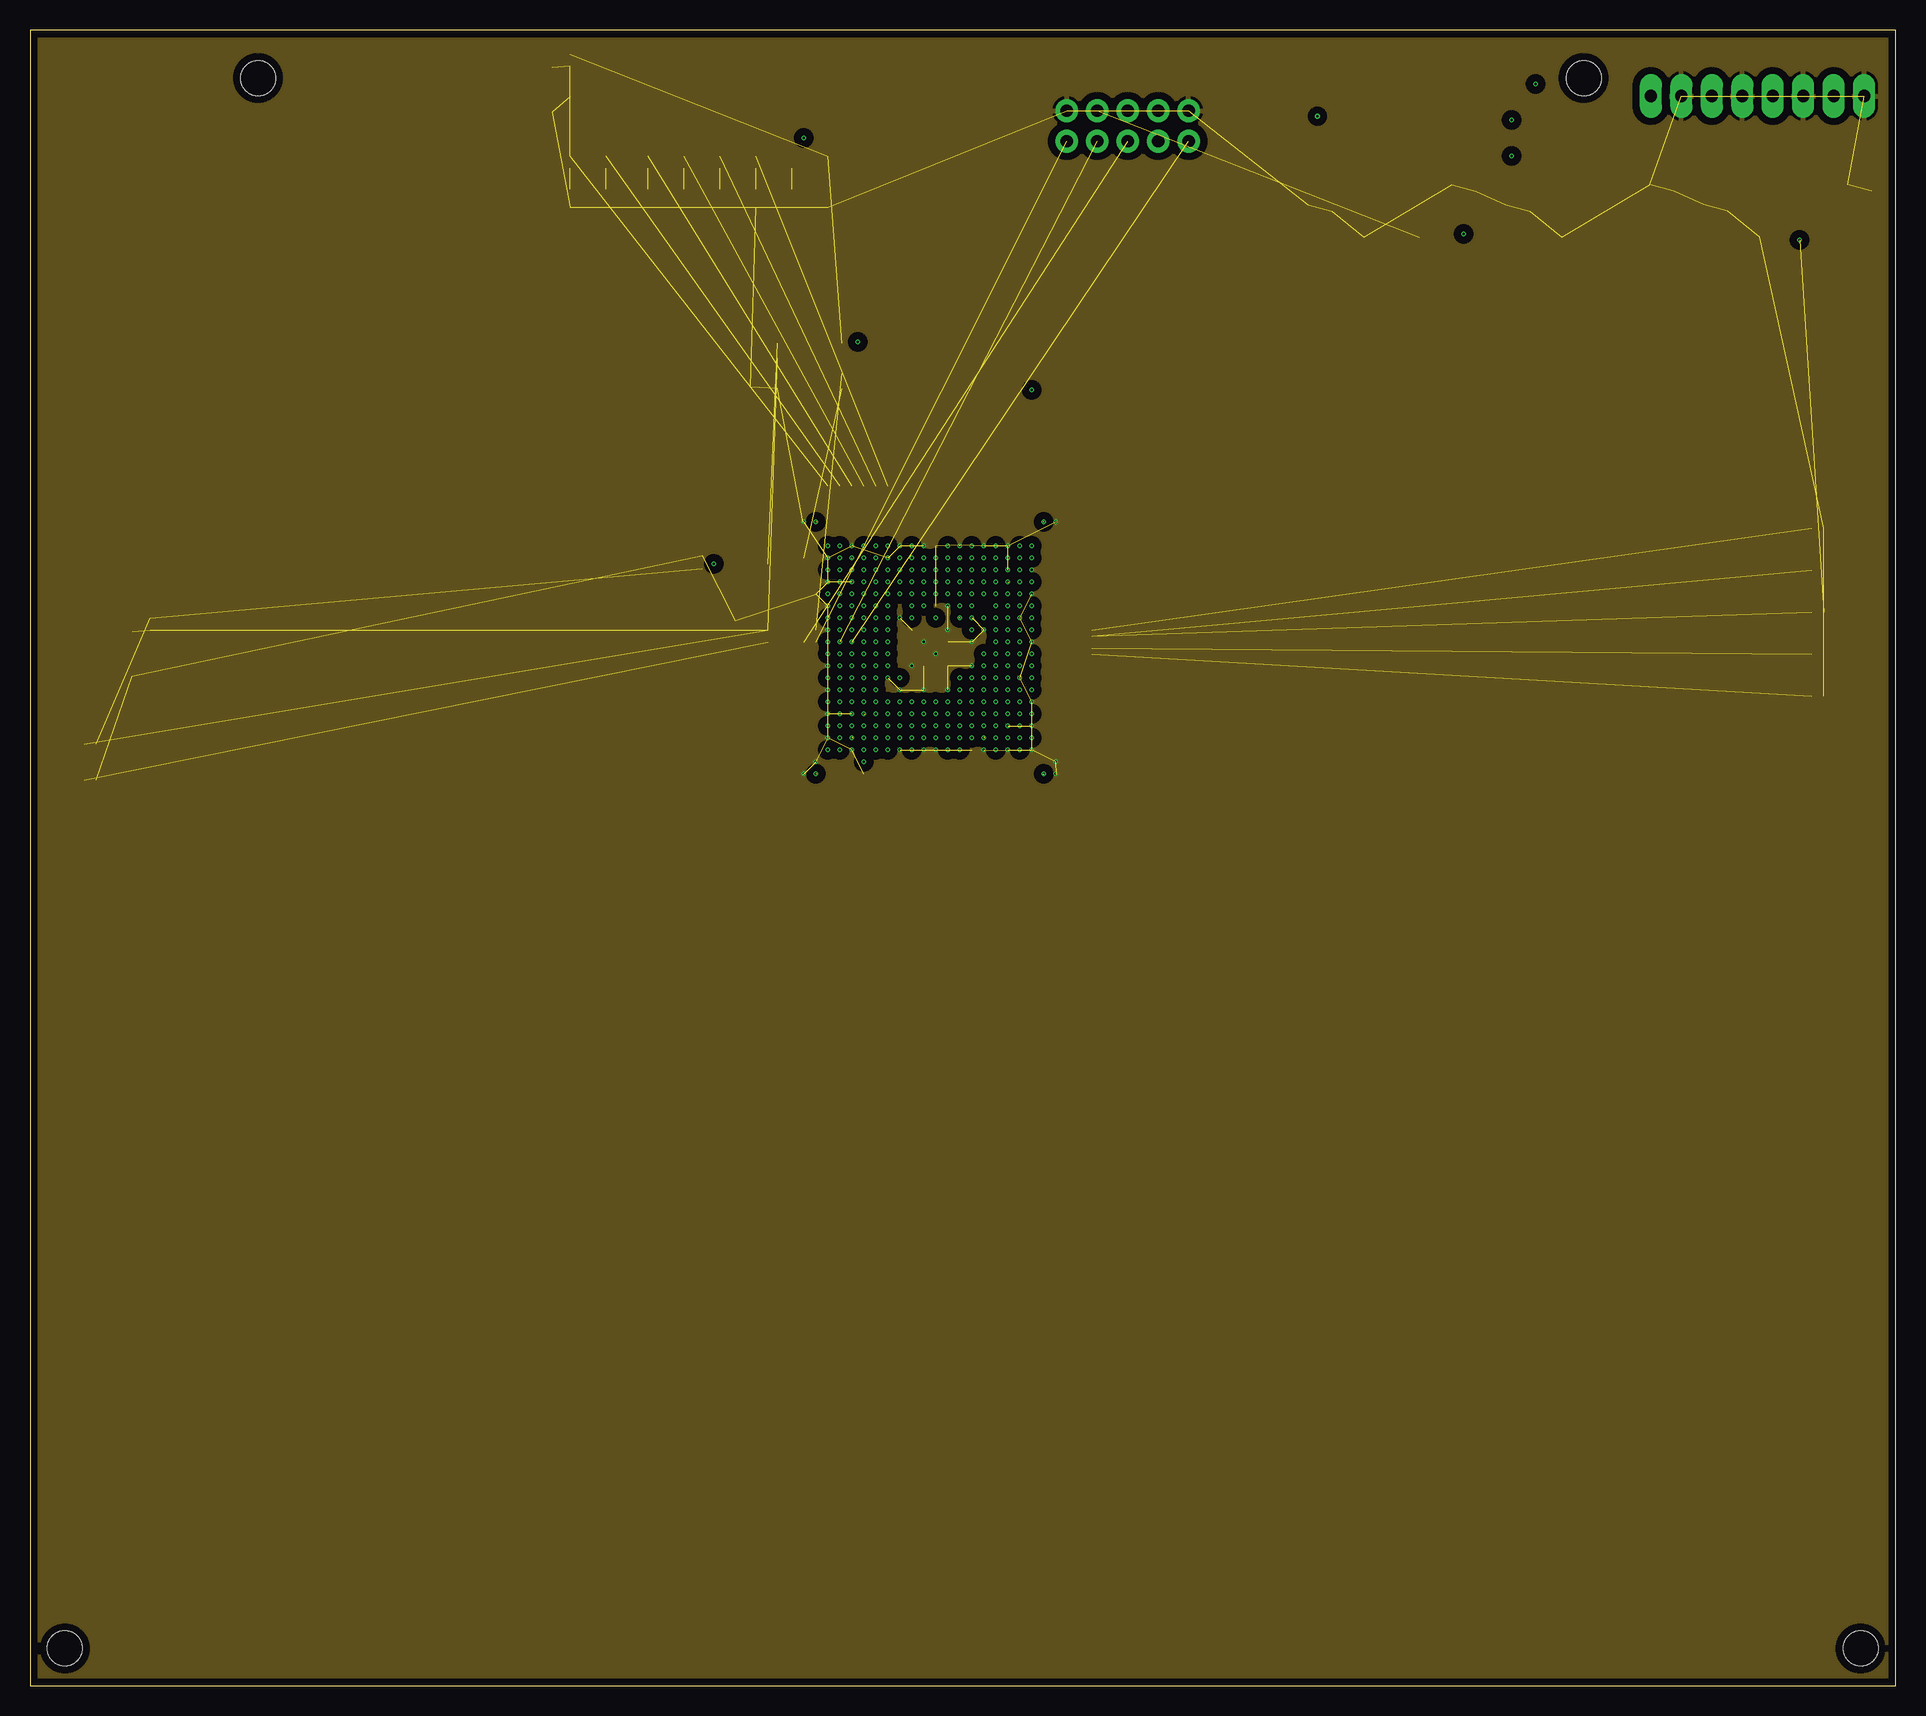
[diagram p12: board, inner layer sig5gnd]
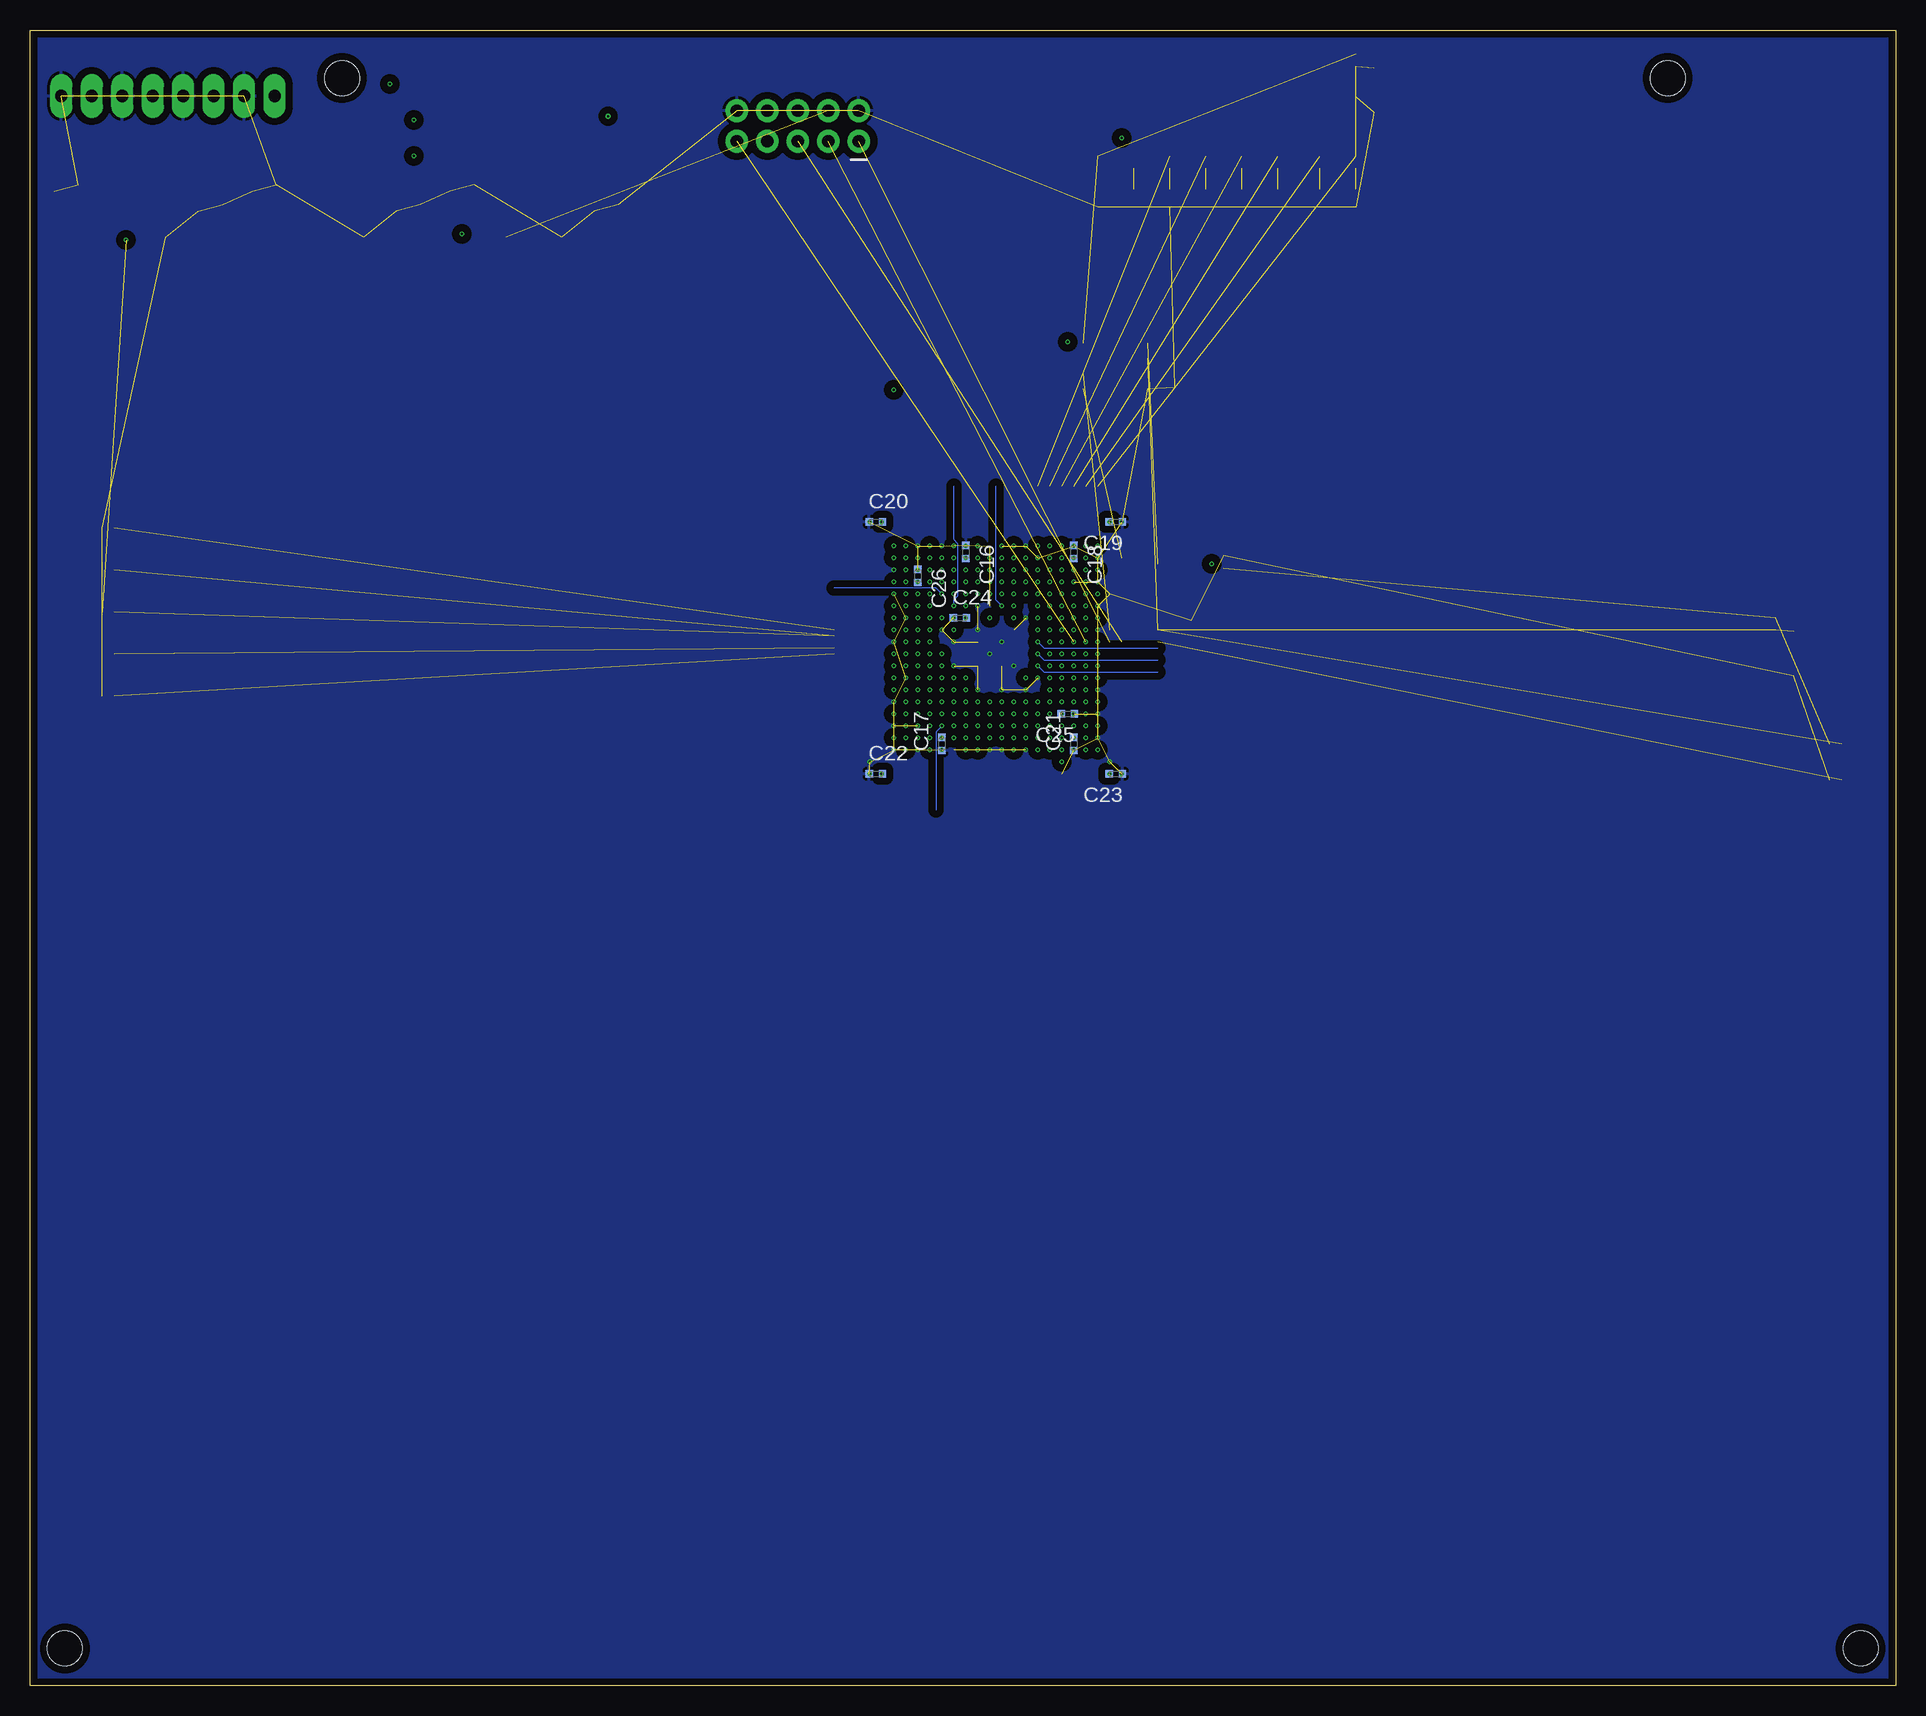
[diagram p13: board, bottom side, seen from below]

Size 155.5 x 138 mm. Coordinates in mm from the lower left corner, seen from the top.
Outline: 0,138 0,0 155.5,0 155.5,138 0,138
Copper layers (1+2*3+4*5+12*13+14*15+16): top 0.035mm / dielectric 0.2mm / topgnd 0.0175mm / dielectric 0.15mm / sig2 0.035mm / dielectric 0.2mm / sig2gnd 0.035mm / dielectric 0.15mm / pow1 0.035mm / dielectric 0.2mm / pow2 0.035mm / dielectric 0.15mm / sig4gnd 0.035mm / dielectric 0.2mm / sig4 0.035mm / dielectric 0.15mm / sig5gnd 0.0175mm / dielectric 0.2mm / sig5 0.035mm
Design rules "jlcpcb-10layers-haas": minimum track width 3.5mil, minimum drill 0.2mm, track to track 3.5mil, track to pad 5mil, pad to pad 5mil, via to via 0.5mm, smd to smd 5mil, copper to edge 0.2mm, drill to drill 6mil, minimum pad ring 10mil, minimum via ring 0.1mm, stop-mask expansion 0.05mm, vias tented up to drill 16mil, thermal gap 10mil
Net classes: 0 default: width 0.089 mm; 1 power: width 0.152 mm; 2 diffpair: width 0.089 mm; 3 loosediffpair: width 0.152 mm, clearance 0.305 mm to class 0, clearance 0.305 mm to class 1, clearance 0.305 mm to class 2, clearance 0.305 mm
Holes 2.9 mm at 2.9,3.1 152.6,3.1 19,134 129.5,134

## Footprints (pad centres in the part's own frame; a part is rotated, then mirrored left to right if it is on the bottom)
RESC0402_N = smd 0.6 x 0.6: 1 -0.55,0; 2 0.55,0
RESC0805_N = smd 1.2 x 1.35: 1 -1.1,0; 2 1,0
BGA484C100P22X22_2300X2300X240 = smd 0.5 x 0.5: A1 -10.5,10.5; A2 -9.5,10.5; A3 -8.5,10.5; A4 -7.5,10.5; A5 -6.5,10.5; A6 -5.5,10.5; A7 -4.5,10.5; A8 -3.5,10.5; A9 -2.5,10.5; A10 -1.5,10.5; A11 -0.5,10.5; A12 0.5,10.5; A13 1.5,10.5; A14 2.5,10.5; A15 3.5,10.5; A16 4.5,10.5; A17 5.5,10.5; A18 6.5,10.5; A19 7.5,10.5; A20 8.5,10.5; A21 9.5,10.5; A22 10.5,10.5; AA1 -10.5,-9.5; AA2 -9.5,-9.5; AA3 -8.5,-9.5; AA4 -7.5,-9.5; AA5 -6.5,-9.5; AA6 -5.5,-9.5; AA7 -4.5,-9.5; AA8 -3.5,-9.5; AA9 -2.5,-9.5; AA10 -1.5,-9.5; AA11 -0.5,-9.5; AA12 0.5,-9.5; AA13 1.5,-9.5; AA14 2.5,-9.5; AA15 3.5,-9.5; AA16 4.5,-9.5; AA17 5.5,-9.5; AA18 6.5,-9.5; AA19 7.5,-9.5; AA20 8.5,-9.5; AA21 9.5,-9.5; AA22 10.5,-9.5; AB1 -10.5,-10.5; AB2 -9.5,-10.5; AB3 -8.5,-10.5; AB4 -7.5,-10.5; AB5 -6.5,-10.5; AB6 -5.5,-10.5; AB7 -4.5,-10.5; AB8 -3.5,-10.5; AB9 -2.5,-10.5; AB10 -1.5,-10.5; AB11 -0.5,-10.5; AB12 0.5,-10.5; AB13 1.5,-10.5; AB14 2.5,-10.5; AB15 3.5,-10.5; AB16 4.5,-10.5; AB17 5.5,-10.5; AB18 6.5,-10.5; AB19 7.5,-10.5; AB20 8.5,-10.5; AB21 9.5,-10.5; AB22 10.5,-10.5; B1 -10.5,9.5; B2 -9.5,9.5; B3 -8.5,9.5; B4 -7.5,9.5; B5 -6.5,9.5; B6 -5.5,9.5; B7 -4.5,9.5; B8 -3.5,9.5; B9 -2.5,9.5; B10 -1.5,9.5; B11 -0.5,9.5; B12 0.5,9.5; B13 1.5,9.5; B14 2.5,9.5; B15 3.5,9.5; B16 4.5,9.5; B17 5.5,9.5; B18 6.5,9.5; B19 7.5,9.5; B20 8.5,9.5; B21 9.5,9.5; B22 10.5,9.5; C1 -10.5,8.5; C2 -9.5,8.5; C3 -8.5,8.5; C4 -7.5,8.5; C5 -6.5,8.5; C6 -5.5,8.5; C7 -4.5,8.5; C8 -3.5,8.5; C9 -2.5,8.5; C10 -1.5,8.5; C11 -0.5,8.5; C12 0.5,8.5; C13 1.5,8.5; C14 2.5,8.5; C15 3.5,8.5; C16 4.5,8.5; C17 5.5,8.5; C18 6.5,8.5; C19 7.5,8.5; C20 8.5,8.5; C21 9.5,8.5; C22 10.5,8.5; D1 -10.5,7.5; D2 -9.5,7.5; D3 -8.5,7.5; D4 -7.5,7.5; D5 -6.5,7.5; D6 -5.5,7.5; D7 -4.5,7.5; D8 -3.5,7.5; D9 -2.5,7.5; D10 -1.5,7.5; D11 -0.5,7.5; D12 0.5,7.5; D13 1.5,7.5; D14 2.5,7.5; D15 3.5,7.5; D16 4.5,7.5; D17 5.5,7.5; D18 6.5,7.5; D19 7.5,7.5; D20 8.5,7.5; D21 9.5,7.5; D22 10.5,7.5; E1 -10.5,6.5; E2 -9.5,6.5; E3 -8.5,6.5; E4 -7.5,6.5; E5 -6.5,6.5; E6 -5.5,6.5; E7 -4.5,6.5; E8 -3.5,6.5; E9 -2.5,6.5; E10 -1.5,6.5; E11 -0.5,6.5; E12 0.5,6.5; E13 1.5,6.5; E14 2.5,6.5; E15 3.5,6.5; E16 4.5,6.5; E17 5.5,6.5; E18 6.5,6.5; E19 7.5,6.5; E20 8.5,6.5; E21 9.5,6.5; E22 10.5,6.5; F1 -10.5,5.5; F2 -9.5,5.5; F3 -8.5,5.5; F4 -7.5,5.5; F5 -6.5,5.5; F6 -5.5,5.5; F7 -4.5,5.5; F8 -3.5,5.5; F9 -2.5,5.5; F10 -1.5,5.5; F11 -0.5,5.5; F12 0.5,5.5; F13 1.5,5.5; F14 2.5,5.5; F15 3.5,5.5; F16 4.5,5.5; F17 5.5,5.5; F18 6.5,5.5; F19 7.5,5.5; F20 8.5,5.5; F21 9.5,5.5; F22 10.5,5.5; G1 -10.5,4.5; G2 -9.5,4.5; G3 -8.5,4.5; G4 -7.5,4.5; G5 -6.5,4.5; G6 -5.5,4.5; G7 -4.5,4.5; G8 -3.5,4.5; G9 -2.5,4.5; G10 -1.5,4.5; G11 -0.5,4.5; G12 0.5,4.5; G13 1.5,4.5; G14 2.5,4.5; G15 3.5,4.5; G16 4.5,4.5; G17 5.5,4.5; G18 6.5,4.5; G19 7.5,4.5; G20 8.5,4.5; G21 9.5,4.5; G22 10.5,4.5; H1 -10.5,3.5; H2 -9.5,3.5; H3 -8.5,3.5; H4 -7.5,3.5; H5 -6.5,3.5; H6 -5.5,3.5; H7 -4.5,3.5; H8 -3.5,3.5; H9 -2.5,3.5; H10 -1.5,3.5; H11 -0.5,3.5; H12 0.5,3.5; H13 1.5,3.5; H14 2.5,3.5; H15 3.5,3.5; H16 4.5,3.5; H17 5.5,3.5; H18 6.5,3.5; H19 7.5,3.5; H20 8.5,3.5; H21 9.5,3.5; H22 10.5,3.5; J1 -10.5,2.5; J2 -9.5,2.5; J3 -8.5,2.5; J4 -7.5,2.5; J5 -6.5,2.5; J6 -5.5,2.5; J7 -4.5,2.5; J8 -3.5,2.5; J9 -2.5,2.5; J10 -1.5,2.5; J11 -0.5,2.5; J12 0.5,2.5; J13 1.5,2.5; J14 2.5,2.5; J15 3.5,2.5; J16 4.5,2.5; J17 5.5,2.5; J18 6.5,2.5; J19 7.5,2.5; J20 8.5,2.5; J21 9.5,2.5; J22 10.5,2.5; K1 -10.5,1.5; K2 -9.5,1.5; K3 -8.5,1.5; K4 -7.5,1.5; K5 -6.5,1.5; K6 -5.5,1.5; K7 -4.5,1.5; K8 -3.5,1.5; K9 -2.5,1.5; K10 -1.5,1.5; K11 -0.5,1.5; K12 0.5,1.5; K13 1.5,1.5; K14 2.5,1.5; K15 3.5,1.5; K16 4.5,1.5; K17 5.5,1.5; K18 6.5,1.5; K19 7.5,1.5; K20 8.5,1.5; K21 9.5,1.5; K22 10.5,1.5; L1 -10.5,0.5; L2 -9.5,0.5; L3 -8.5,0.5; L4 -7.5,0.5; L5 -6.5,0.5; L6 -5.5,0.5; L7 -4.5,0.5; L8 -3.5,0.5; L9 -2.5,0.5; L10 -1.5,0.5; L11 -0.5,0.5; L12 0.5,0.5; L13 1.5,0.5; L14 2.5,0.5; L15 3.5,0.5; L16 4.5,0.5; L17 5.5,0.5; L18 6.5,0.5; L19 7.5,0.5; L20 8.5,0.5; L21 9.5,0.5; L22 10.5,0.5; M1 -10.5,-0.5; M2 -9.5,-0.5; M3 -8.5,-0.5; M4 -7.5,-0.5; M5 -6.5,-0.5; M6 -5.5,-0.5; M7 -4.5,-0.5; M8 -3.5,-0.5; M9 -2.5,-0.5; M10 -1.5,-0.5; M11 -0.5,-0.5; M12 0.5,-0.5; M13 1.5,-0.5; M14 2.5,-0.5; M15 3.5,-0.5; M16 4.5,-0.5; M17 5.5,-0.5; M18 6.5,-0.5; M19 7.5,-0.5; M20 8.5,-0.5; M21 9.5,-0.5; M22 10.5,-0.5; N1 -10.5,-1.5; N2 -9.5,-1.5; N3 -8.5,-1.5; N4 -7.5,-1.5; N5 -6.5,-1.5; N6 -5.5,-1.5; N7 -4.5,-1.5; N8 -3.5,-1.5; N9 -2.5,-1.5; N10 -1.5,-1.5; N11 -0.5,-1.5; N12 0.5,-1.5; N13 1.5,-1.5; N14 2.5,-1.5; N15 3.5,-1.5; N16 4.5,-1.5; N17 5.5,-1.5; N18 6.5,-1.5; N19 7.5,-1.5; N20 8.5,-1.5; N21 9.5,-1.5; N22 10.5,-1.5; P1 -10.5,-2.5; P2 -9.5,-2.5; P3 -8.5,-2.5; P4 -7.5,-2.5; P5 -6.5,-2.5; P6 -5.5,-2.5; P7 -4.5,-2.5; P8 -3.5,-2.5; P9 -2.5,-2.5; P10 -1.5,-2.5; P11 -0.5,-2.5; P12 0.5,-2.5; P13 1.5,-2.5; P14 2.5,-2.5; P15 3.5,-2.5; P16 4.5,-2.5; P17 5.5,-2.5; P18 6.5,-2.5; P19 7.5,-2.5; P20 8.5,-2.5; P21 9.5,-2.5; P22 10.5,-2.5; R1 -10.5,-3.5; R2 -9.5,-3.5; R3 -8.5,-3.5; R4 -7.5,-3.5; R5 -6.5,-3.5; R6 -5.5,-3.5; R7 -4.5,-3.5; R8 -3.5,-3.5; R9 -2.5,-3.5; R10 -1.5,-3.5; R11 -0.5,-3.5; R12 0.5,-3.5; R13 1.5,-3.5; R14 2.5,-3.5; R15 3.5,-3.5; R16 4.5,-3.5; R17 5.5,-3.5; R18 6.5,-3.5; R19 7.5,-3.5; R20 8.5,-3.5; R21 9.5,-3.5; R22 10.5,-3.5; T1 -10.5,-4.5; T2 -9.5,-4.5; T3 -8.5,-4.5; T4 -7.5,-4.5; T5 -6.5,-4.5; T6 -5.5,-4.5; T7 -4.5,-4.5; T8 -3.5,-4.5; T9 -2.5,-4.5; T10 -1.5,-4.5; T11 -0.5,-4.5; T12 0.5,-4.5; T13 1.5,-4.5; T14 2.5,-4.5; T15 3.5,-4.5; T16 4.5,-4.5; T17 5.5,-4.5; T18 6.5,-4.5; T19 7.5,-4.5; T20 8.5,-4.5; T21 9.5,-4.5; T22 10.5,-4.5; U1 -10.5,-5.5; U2 -9.5,-5.5; U3 -8.5,-5.5; U4 -7.5,-5.5; U5 -6.5,-5.5; U6 -5.5,-5.5; U7 -4.5,-5.5; U8 -3.5,-5.5; U9 -2.5,-5.5; U10 -1.5,-5.5; U11 -0.5,-5.5; U12 0.5,-5.5; U13 1.5,-5.5; U14 2.5,-5.5; U15 3.5,-5.5; U16 4.5,-5.5; U17 5.5,-5.5; U18 6.5,-5.5; U19 7.5,-5.5; U20 8.5,-5.5; U21 9.5,-5.5; U22 10.5,-5.5; V1 -10.5,-6.5; V2 -9.5,-6.5; V3 -8.5,-6.5; V4 -7.5,-6.5; V5 -6.5,-6.5; V6 -5.5,-6.5; V7 -4.5,-6.5; V8 -3.5,-6.5; V9 -2.5,-6.5; V10 -1.5,-6.5; V11 -0.5,-6.5; V12 0.5,-6.5; V13 1.5,-6.5; V14 2.5,-6.5; V15 3.5,-6.5; V16 4.5,-6.5; V17 5.5,-6.5; V18 6.5,-6.5; V19 7.5,-6.5; V20 8.5,-6.5; V21 9.5,-6.5; V22 10.5,-6.5; W1 -10.5,-7.5; W2 -9.5,-7.5; W3 -8.5,-7.5; W4 -7.5,-7.5; W5 -6.5,-7.5; W6 -5.5,-7.5; W7 -4.5,-7.5; W8 -3.5,-7.5; W9 -2.5,-7.5; W10 -1.5,-7.5; W11 -0.5,-7.5; W12 0.5,-7.5; W13 1.5,-7.5; W14 2.5,-7.5; W15 3.5,-7.5; W16 4.5,-7.5; W17 5.5,-7.5; W18 6.5,-7.5; W19 7.5,-7.5; W20 8.5,-7.5; W21 9.5,-7.5; W22 10.5,-7.5; Y1 -10.5,-8.5; Y2 -9.5,-8.5; Y3 -8.5,-8.5; Y4 -7.5,-8.5; Y5 -6.5,-8.5; Y6 -5.5,-8.5; Y7 -4.5,-8.5; Y8 -3.5,-8.5; Y9 -2.5,-8.5; Y10 -1.5,-8.5; Y11 -0.5,-8.5; Y12 0.5,-8.5; Y13 1.5,-8.5; Y14 2.5,-8.5; Y15 3.5,-8.5; Y16 4.5,-8.5; Y17 5.5,-8.5; Y18 6.5,-8.5; Y19 7.5,-8.5; Y20 8.5,-8.5; Y21 9.5,-8.5; Y22 10.5,-8.5
SOIC127P600X175-8N = smd 1.5 x 0.7: 1 -2.7,1.905; 2 -2.7,0.635; 3 -2.7,-0.635; 4 -2.7,-1.905; 5 2.7,-1.905; 6 2.7,-0.635; 7 2.7,0.635; 8 2.7,1.905
2X5-SHROUDED = drill 1.016 pad 1.88: 1 -1.27,5.08; 2 1.27,5.08; 3 -1.27,2.54; 4 1.27,2.54; 5 -1.27,0; 6 1.27,0; 7 -1.27,-2.54; 8 1.27,-2.54; 9 -1.27,-5.08; 10 1.27,-5.08
1X08 = drill 1.016 long: 1 -8.89,0; 2 -6.35,0; 3 -3.81,0; 4 -1.27,0; 5 1.27,0; 6 3.81,0; 7 6.35,0; 8 8.89,0
CHIP-LED0603 = smd 0.8 x 0.8: A 0,-0.75; C 0,0.75
RES-0402 = smd 0.5 x 0.6: P$1 -0.5,0; P$2 0.5,0
SW4-SMD-5.2X5.2X1.5MM = smd 1 x 0.7: 1 -3,1.85; 2 3,1.85; 3 -3,-1.85; 4 3,-1.85
SOT-223-3 = smd 1.5 x 4: P$1 3.25,0 | smd 1.5 x 1: P$2 -3.25,2.3; P$3 -3.25,0; P$4 -3.25,-2.3
OSCILLATOR-SMD-5X3.2 = smd 1.397 x 1.194: 1 -1.27,-1.1; 2 1.27,-1.1; 3 1.27,1.1; 4 -1.27,1.1

## Placement (x,y rotation side)
C1  0.1uF  [RESC0402_N]  60.06,108.8 90 top
C2  10uF  [RESC0805_N]  125,124 90 top
C3  0.1uF  [RESC0402_N]  123,124 90 top
C4  10uF  [RESC0805_N]  108.5,124 90 top
C5  0.1uF  [RESC0402_N]  106.5,124 90 top
C6  10uF  [RESC0805_N]  151.5,124 270 top
C7  0.1uF  [RESC0402_N]  153.5,124 270 top
C8  10uF  [RESC0805_N]  141.5,124 90 top
C9  0.1uF  [RESC0402_N]  139.5,124 90 top
C10  10uF  [RESC0805_N]  135,124 270 top
C11  0.1uF  [RESC0402_N]  137,124 270 top
C12  10uF  [RESC0805_N]  118.5,124 270 top
C13  0.1uF  [RESC0402_N]  120.5,124 270 top
C14  0.1uF  [RESC0402_N]  56.02,93.64 270 top
C15  0.1uF  [RESC0402_N]  45,133 90 top
C16  0.1uF  [RESC0402_N]  77.5,94.5 270 bottom
C17  0.1uF  [RESC0402_N]  79.5,78.5 90 bottom
C18  0.1uF  [RESC0402_N]  68.5,94.5 270 bottom
C19  0.1uF  [RESC0402_N]  65,97 180 bottom
C20  0.1uF  [RESC0402_N]  85,97 0 bottom
C21  0.1uF  [RESC0402_N]  68.5,78.5 90 bottom
C22  0.1uF  [RESC0402_N]  85,76 0 bottom
C23  0.1uF  [RESC0402_N]  65,76 180 bottom
C24  0.1uF  [RESC0402_N]  78,89 0 bottom
C25  0.1uF  [RESC0402_N]  69,81 180 bottom
C26  0.1uF  [RESC0402_N]  81.5,92.5 270 bottom
IC1  EP4CE30F23C6N  [BGA484C100P22X22_2300X2300X240]  75,86.5 0 top
IC2  EPCQ16ASI8N  [SOIC127P600X175-8N]  65,110 0 top
J1  2x5  [2X5-SHROUDED]  91.5,130 90 top
JP3  1x8  [1X08]  144,132.5 0 top
LED33  red  [CHIP-LED0603]  45,124 180 top
LED34  red  [CHIP-LED0603]  48,124 180 top
LED35  red  [CHIP-LED0603]  51.5,124 180 top
LED36  red  [CHIP-LED0603]  54.5,124 180 top
LED37  red  [CHIP-LED0603]  57.5,124 180 top
LED38  red  [CHIP-LED0603]  60.5,124 180 top
LED39  red  [CHIP-LED0603]  63.5,124 180 top
LED40  red  [CHIP-LED0603]  66.5,124 180 top
R1  10k  [RES-0402]  45,135.5 90 top
R2  10k  [RES-0402]  10,88.5 90 top
R3  10k  [RES-0402]  149,86 0 top
R4  0  [RES-0402]  5,75.5 0 top
R5  10k  [RES-0402]  5,78.5 0 top
R6  10k  [RES-0402]  149,82.5 0 top
R7  10k  [RES-0402]  149,89.5 0 top
R8  10k  [RES-0402]  149,93 0 top
R9  10k  [RES-0402]  149,96.5 0 top
R17  0  [RES-0402]  125,131.5 180 top
R18  0  [RES-0402]  108.5,128.5 180 top
R19  0  [RES-0402]  108.5,131.5 180 top
R20  0  [RES-0402]  125,128.5 180 top
R38  1k  [RES-0402]  66.5,127 270 top
R39  1k  [RES-0402]  63.5,127 270 top
R40  1k  [RES-0402]  60.5,127 270 top
R41  1k  [RES-0402]  57.5,127 270 top
R42  1k  [RES-0402]  54.5,127 270 top
R43  1k  [RES-0402]  51.5,127 270 top
R44  1k  [RES-0402]  48,127 270 top
R45  1k  [RES-0402]  45,127 270 top
SW1  SKQGADE010  [SW4-SMD-5.2X5.2X1.5MM]  5.5,86 0 top
SW2  SKQGADE010  [SW4-SMD-5.2X5.2X1.5MM]  40.5,133 0 top
U1  AMS1117-3.3  [SOT-223-3]  146.5,124 90 top
U2  AMS1117-2.5  [SOT-223-3]  130,124 90 top
U3  AMS1117-1.2  [SOT-223-3]  113.5,124 90 top
Y1  OSCILLATORSMD-5X3  [OSCILLATOR-SMD-5X3.2]  57.48,89.86 0 top

## Tracks (layer width: path | path; a pad name or v marks a point on that pad's centre or on a via)
1V2
  top 0.406: JP3.7 149.06,133.8 149.06,133.93 146.49,136.5 122.75,136.5 U3.P$1 | U3.P$1 U3.P$3 | R19.P$1 R18.P$1 109,127.5 | 109,127.5 109,125.5 C4.2 108.05,124.55 C5.2 | U3.P$1 109.25,127.25 109,127.5
2V5  (via drill 0.2)
  top 0.406: JP3.5 143.97,133.8 143.97,133.93 142.91,135 134.94,135 130,130.06 U2.P$1 | U2.P$1 U2.P$3 | 125.5,127 R20.P$1 125.5,131 R17.P$1 v125.5,133.5 | 125.5,127 125.5,125.5 C2.2 124.55,124.55 C3.2 | U2.P$1 125.75,127.25 125.5,127 | R39.P$1 64.5,128.5 v64.5,129
  pow2 0.406: v64.5,129 70,134.5 124.5,134.5 v125.5,133.5
3V3  (via drill 0.2)  (7 unrouted)
  top 0.406: C8.2 143.75,127.25 U1.P$1 U1.P$3 147.25,120.75 v147.5,120.5 | C8.2 140.19,126.31 JP3.3 | C8.2 141.05,124.55 C9.2 | C12.2 119.5,122 v119.5,121 | C12.2 116.25,120.75 U3.P$4 | C12.2 120.05,123 C13.2 | R38.P$1 71.5,132.5 85.85,132.5 85.89,132.54 87.69,132.54 J1.4 | v69,112 67.8,112 IC2.8 IC2.7 67.11,110.05 66.81,110.05 66.13,109.37 IC2.3 60.08,109.37 C1.2 | v57,93.5 56.59,93.09 C14.2 56.02,91.15 Y1.4
  pow2 0.406: v119.5,121 147,121 v147.5,120.5 | v69,112 69,110 58.5,99.5 58.5,95 v57,93.5
5V
  top 0.406: C7.2 151.95,123.45 C6.2 151.05,123 U1.P$4 148.8,119.3 148.5,119 141,119 138.5,121.5 138.5,123 | JP3.1 135.11,128.89 138.5,125.5 138.5,123 | 138.5,123 138.05,123.45 C11.2 136.55,123 C10.2 132.75,120.75 U2.P$4 132.05,120.5 132,120.56 132,119.5
ASDO  (1 unrouted)
  top 0.089: IC1.D1 61.5,94
CLK1
  top 0.089: IC1.G1 58.79,91 Y1.3
CLK2
  top 0.089: IC1.T2 65.1,82 64.67,82.42 61.58,82.42 61.5,82.5
CLK3
  top 0.089: IC1.T1 61.5,82
CLK4
  top 0.089: IC1.G21 85,91.5 88.5,91.5
CLK5
  top 0.089: IC1.G22 88.5,91
CLK6
  top 0.089: IC1.T21 85,81.5 88.5,81.5
CLK7
  top 0.089: IC1.T22 88.5,82
CLK8
  top 0.089: IC1.A12 75.5,100
CLK9
  top 0.089: IC1.B12 76,96.5 76,100
CLK10
  top 0.089: 74.5,100 IC1.A11
CLK11
  top 0.089: IC1.B11 75,96.5 75,100
CLK12
  top 0.089: IC1.AB12 75.5,73
CLK13
  top 0.089: IC1.AA12 75,76.5 75,73
CLK14
  top 0.089: IC1.AB11 74.5,73
CLK15
  top 0.089: IC1.AA11 74,76.5 74,73
CONF_DONE  (via drill 0.2)  (1 unrouted)
  sig2 0.089: 88.5,86.5 83.78,86.5 83.73,86.55 82.05,86.55 IC1.M18
  other vias: 81.5,86
DATA0  (1 unrouted)
  top 0.089: IC1.K1 61.5,88
DCLK  (1 unrouted)
  top 0.089: IC1.K2 65,88.5 61.5,88.5
GND  (via drill 0.2)  (101 unrouted)
  top 0.152: IC1.H12 IC1.H13 | IC1.E18 81.86,93 82.31,93.45 82.69,93.45 83.14,93 IC1.E20 83.5,92.64 83.05,92.19 83.05,91.81 83.5,91.36 IC1.G20 | IC1.C12 IC1.C11 | IC1.Y15 IC1.Y16 | IC1.L11 IC1.K11 IC1.K10 IC1.L10 IC1.M10 IC1.N10 IC1.N11 IC1.M11 IC1.M12 IC1.N12 IC1.N13 IC1.M13 IC1.L13 IC1.L12 IC1.K12 IC1.K13
  other vias: 79.5,95 81.5,95 81.5,93 82.5,89 78.5,89 79.5,88 73.5,85 76.5,88 68.5,81 77.5,95 83.5,87 78.5,85 78.5,87 82.5,84 83.5,82 83.5,80 83.5,78 76.5,83 74.5,83 74.5,78 75.5,78 81.5,80 81.5,78 66.5,83 66.5,81 66.5,79 72.5,78 72.5,83 68.5,78 71.5,84 72.5,89 66.5,90 66.5,88 66.5,85 66.5,92 68.5,92 66.5,94 68.5,95 72.5,95 74.5,95 71.5,94 76.5,90 75.5,92 83.5,93 83.5,91 64.5,76 64.5,97 85.5,97 85.5,76 79.5,78 75.5,86 74.5,87 65.5,77 85.5,77
  pour sig2gnd (isolate 0.61): 158.5,141 158.5,139.5 158.5,139.5 158.5,-2.5 -2,-2.5 -2,139.5
  pour topgnd (isolate 0.61): 158,141 158,139.5 158,139.5 158,-1.5 -2,-1.5 -2,139.5
  pour sig4gnd (isolate 0.61): 158.5,139.5 158.5,139.5 158.5,-2.5 -1.5,-2.5 -1.5,139.5
  pour sig5gnd (isolate 0.61): 158,139.5 158,139.5 158,-2.5 -2,-2.5 -2,139.5
  pour top (isolate 0.61): -3.5,140 158.5,141.5 158.5,141.5 158.5,-4 -3.5,-4
  pour sig5 (isolate 0.61): -2,139 158.5,140.5 158.5,140.5 158.5,-2 -2,-2
IO1  (4 unrouted)
  top 0.089: IC1.A3 66.5,100
IO2  (1 unrouted)
  top 0.089: IC1.A4 67.5,100
IO3  (1 unrouted)
  top 0.089: IC1.A5 68.5,100
IO4  (1 unrouted)
  top 0.089: IC1.A6 69.5,100
IO5  (1 unrouted)
  top 0.089: IC1.A7 70.5,100
IO6  (1 unrouted)
  top 0.089: IC1.A8 71.5,100
IO7
  top 0.089: IC1.A9 72.5,100
IO8
  top 0.089: IC1.A10 73.5,100
IO9
  top 0.089: IC1.A13 76.5,100
IO10
  top 0.089: IC1.A14 77.5,100
IO11
  top 0.089: IC1.A15 78.5,100
IO12
  top 0.089: IC1.A16 79.5,100
IO13
  top 0.089: IC1.A17 80.5,100
IO14
  top 0.089: IC1.A18 81.5,100
IO15
  top 0.089: IC1.A19 82.5,100
IO16
  top 0.089: IC1.A20 83.5,100
IO17
  top 0.089: IC1.B1 61.5,96
IO18
  top 0.089: IC1.B2 66.01,96.51 66.01,100.17
IO19
  top 0.089: IC1.B3 67,96.5 67,100
IO20
  top 0.089: IC1.B4 68,96.5 68,100
IO21
  top 0.089: IC1.B5 69,96.5 69,100
IO22
  top 0.089: IC1.B6 70,96.5 70,100
IO23
  top 0.089: IC1.B7 71,96.5 71,100
IO24
  top 0.089: IC1.B8 72,96.5 72,100
IO25
  top 0.089: IC1.B9 73,96.5 73,100
IO26
  top 0.089: IC1.B10 74,96.5 74,100
IO27
  top 0.089: IC1.B13 77,96.5 77,100
IO28
  top 0.089: IC1.B14 78,96.5 78,100
IO29
  top 0.089: IC1.B15 79,96.5 79,100
IO30
  top 0.089: IC1.B16 80,96.5 80,100
IO31
  top 0.089: IC1.B17 81,96.5 81,100
IO32
  top 0.089: IC1.B18 82,96.5 82,100
IO33
  top 0.089: IC1.B19 83,96.5 83,100
IO34
  top 0.089: IC1.B20 84,96.5 84,100
IO35
  top 0.089: IC1.B21 85,96.5 88.5,96.5
IO36
  top 0.089: IC1.B22 88.5,96
IO37
  top 0.089: IC1.C1 61.5,95
IO38
  top 0.089: IC1.C2 65,95.5 61.5,95.5
IO39  (via drill 0.2)
  sig2 0.089: IC1.C3 61.5,95
  other vias: 66.5,95
IO40  (via drill 0.2)
  sig2 0.089: IC1.C4 67.03,95 66.65,95.37 61.63,95.37 61.5,95.5
  other vias: 67.5,95
IO41  (via drill 0.2)
  sig2 0.089: IC1.C6 69.5,100
  other vias: 69.5,95
IO42  (via drill 0.2)
  sig2 0.089: IC1.C7 70.5,100
  other vias: 70.5,95
IO43  (via drill 0.2)
  sig2 0.089: IC1.C8 71.5,100
  other vias: 71.5,95
IO44  (via drill 0.2)
  sig2 0.089: IC1.C10 73.5,100
  other vias: 73.5,95
IO45  (via drill 0.2)
  sig2 0.089: IC1.C13 76.5,100
  other vias: 76.5,95
IO46  (via drill 0.2)
  sig2 0.089: IC1.C15 78.5,100
  other vias: 78.5,95
IO47  (via drill 0.2)
  sig2 0.089: IC1.C17 80.5,100
  other vias: 80.5,95
IO48  (via drill 0.2)
  sig2 0.089: 88.5,95.18 83.85,95.18 83.65,95.37 83.35,95.37 82.97,95 IC1.C19
  other vias: 82.5,95
IO49  (via drill 0.2)
  sig2 0.089: IC1.C20 88.5,95
  other vias: 83.5,95
IO50
  top 0.089: IC1.C21 85,95.5 88.5,95.5
IO51
  top 0.089: IC1.C22 88.5,95
IO53
  top 0.089: IC1.D2 65,94.5 61.5,94.5
IO54  (via drill 0.2)
  sig2 0.089: IC1.D6 69.5,94.47 69.87,94.85 69.87,99.87 70,100
  other vias: 69.5,94
IO55  (via drill 0.2)
  sig2 0.089: IC1.D7 70.5,94.47 70.87,94.85 70.87,99.87 71,100
  other vias: 70.5,94
IO56  (via drill 0.2)
  sig2 0.089: IC1.D10 73.5,94.47 73.87,94.85 73.87,99.87 74,100
  other vias: 73.5,94
IO57  (via drill 0.2)
  sig2 0.089: 76.32,100 76.32,95.35 76.13,95.15 76.13,94.85 76.5,94.47 IC1.D13
  other vias: 76.5,94
IO58  (via drill 0.2)
  sig2 0.089: 78.32,100 78.32,95.35 78.13,95.15 78.13,94.85 78.5,94.47 IC1.D15
  other vias: 78.5,94
IO59  (via drill 0.2)
  sig2 0.089: 80.32,100 80.32,95.35 80.13,95.15 80.13,94.85 80.5,94.47 IC1.D17
  other vias: 80.5,94
IO60  (via drill 0.2)
  sig2 0.089: IC1.D19 82.97,94 83.35,94.37 83.65,94.37 83.85,94.18 88.5,94.18
  other vias: 82.5,94
IO61  (via drill 0.2)
  sig2 0.089: IC1.D20 88.5,94
  other vias: 83.5,94
IO62
  top 0.089: IC1.D21 85,94.5 88.5,94.5
IO63
  top 0.089: IC1.D22 88.5,94
IO64
  top 0.089: IC1.E1 61.5,93
IO66  (via drill 0.2)
  sig2 0.089: IC1.E3 61.5,93
  other vias: 66.5,93
IO67  (via drill 0.2)
  sig2 0.089: IC1.E4 67.03,93 66.65,93.37 61.63,93.37 61.5,93.5
  other vias: 67.5,93
IO68  (via drill 0.2)
  sig2 0.089: IC1.E5 68.03,93 67.65,92.63 61.63,92.63 61.5,92.5
  other vias: 68.5,93
IO69  (via drill 0.2)
  sig2 0.089: IC1.E6 69.03,93 68.48,93.55 61.95,93.55 61.5,94
  other vias: 69.5,93
IO70  (via drill 0.2)
  sig2 0.089: IC1.E7 70.5,93.47 71.05,94.02 71.05,99.55 71.32,99.82 71.32,100
  other vias: 70.5,93
IO71  (via drill 0.2)
  sig2 0.089: IC1.E9 72.5,93.47 72.13,93.85 72.13,95.15 72.5,95.53 72.5,100
  other vias: 72.5,93
IO72  (via drill 0.2)
  sig2 0.089: 73.32,100 73.32,95.35 73.13,95.15 73.13,93.85 73.5,93.47 IC1.E10
  other vias: 73.5,93
IO73  (via drill 0.2)
  sig2 0.089: IC1.E11 74.5,93.47 74.13,93.85 74.13,95.15 74.5,95.53 74.5,100
  other vias: 74.5,93
IO74  (via drill 0.2)
  sig2 0.089: IC1.E12 75.5,93.47 75.13,93.85 75.13,94.15 75.5,94.53 75.5,100
  other vias: 75.5,93
IO75  (via drill 0.2)
  sig2 0.089: IC1.E13 76.5,93.47 76.87,93.85 76.87,99.87 77,100
  other vias: 76.5,93
IO76  (via drill 0.2)
  sig2 0.089: IC1.E14 77.5,93.47 77.13,93.85 77.13,95.15 77.5,95.53 77.5,100
  other vias: 77.5,93
IO77  (via drill 0.2)
  sig2 0.089: 78,100 78,95.28 77.95,95.23 77.95,93.55 IC1.E15
  other vias: 78.5,93
IO78  (via drill 0.2)
  sig2 0.089: IC1.E16 79.5,93.47 79.13,93.85 79.13,95.15 79.5,95.53 79.5,100
  other vias: 79.5,93
IO79
  top 0.089: IC1.E21 85,93.5 88.5,93.5
IO80
  top 0.089: IC1.E22 88.5,93
IO81
  top 0.089: IC1.F1 61.5,92
IO82
  top 0.089: IC1.F2 65,92.5 61.5,92.5
IO83  (via drill 0.2)
  sig4 0.089: IC1.F7 70.5,92.47 70.13,92.85 70.13,97.87 70,98 70,100
  other vias: 70.5,92
IO84  (via drill 0.2)
  sig4 0.089: IC1.F8 71,92.5 71,100
  other vias: 71.5,92
IO85  (via drill 0.2)
  sig4 0.089: IC1.F9 72,92.5 72,100
  other vias: 72.5,92
IO86  (via drill 0.2)
  sig4 0.089: IC1.F10 73.5,92.47 73.13,92.85 73.13,95.15 73.5,95.53 73.5,100
  other vias: 73.5,92
IO87  (via drill 0.2)
  sig4 0.089: IC1.F11 74.5,92.47 74.13,92.85 74.13,95.15 74.5,95.53 74.5,100
  other vias: 74.5,92
IO88  (via drill 0.2)
  sig4 0.089: IC1.F13 76.5,92.47 76.13,92.85 76.13,95.15 76.5,95.53 76.5,100
  other vias: 76.5,92
IO89  (via drill 0.2)
  sig4 0.089: IC1.F14 77.5,92.47 77.13,92.85 77.13,95.15 77.5,95.53 77.5,100
  other vias: 77.5,92
IO90  (via drill 0.2)
  sig4 0.089: IC1.F15 78.5,92.47 78.13,92.85 78.13,95.15 78.5,95.53 78.5,100
  other vias: 78.5,92
IO91  (via drill 0.2)
  sig2 0.089: IC1.F16 78.95,92.55 78.95,95.23 79,95.28 79,100
  other vias: 79.5,92
IO92  (via drill 0.2)
  sig2 0.089: 80,100 80,95.28 79.95,95.23 79.95,92.55 IC1.F17
  other vias: 80.5,92
IO93  (via drill 0.2)
  sig2 0.089: IC1.F19 82.97,92 83.35,92.37 83.65,92.37 83.85,92.18 88.5,92.18
  other vias: 82.5,92
IO94  (via drill 0.2)
  sig2 0.089: IC1.F20 88.5,92
  other vias: 83.5,92
IO95
  top 0.089: IC1.F21 85,92.5 88.5,92.5
IO96
  top 0.089: IC1.F22 88.5,92
IO97  (via drill 0.2)
  sig2 0.089: IC1.G3 61.5,91
  other vias: 66.5,91
IO98  (via drill 0.2)
  sig2 0.089: IC1.G4 67.03,91 66.65,91.37 66.35,91.37 66.15,91.18 61.82,91.18 61.5,91.5
  other vias: 67.5,91
IO99  (via drill 0.2)
  sig2 0.089: 61.5,92 62,91.5 66.22,91.5 66.27,91.55 67.95,91.55 IC1.G5
  other vias: 68.5,91
IO100  (via drill 0.2)
  sig4 0.089: IC1.G7 70.03,91 69.65,90.63 66.35,90.63 65.97,91 61.5,91
  other vias: 70.5,91
IO101  (via drill 0.2)
  sig4 0.089: IC1.G8 71.03,91 70.65,91.37 66.35,91.37 66.15,91.18 61.82,91.18 61.5,91.5
  other vias: 71.5,91
IO102  (via drill 0.2)
  sig4 0.089: IC1.G9 72.03,91 71.48,91.55 66.27,91.55 66.22,91.5 62,91.5 61.5,92
  other vias: 72.5,91
IO103  (via drill 0.2)
  sig4 0.089: 73,100 73,95.28 72.95,95.23 72.95,91.55 IC1.G10
  other vias: 73.5,91
IO104  (via drill 0.2)
  sig4 0.089: 74,100 74,95.28 73.95,95.23 73.95,91.55 IC1.G11
  other vias: 74.5,91
IO105  (via drill 0.2)
  sig4 0.089: 76,100 76,95.28 75.95,95.23 75.95,91.55 IC1.G13
  other vias: 76.5,91
IO106  (via drill 0.2)
  sig4 0.089: 77,100 77,95.28 76.95,95.23 76.95,91.55 IC1.G14
  other vias: 77.5,91
IO107  (via drill 0.2)
  sig4 0.089: 78,100 78,95.28 77.95,95.23 77.95,91.55 IC1.G15
  other vias: 78.5,91
IO108  (via drill 0.2)
  sig5 0.089: 88.5,91.5 81.89,91.5 81.87,91.48 79.98,91.48 IC1.G16
  other vias: 79.5,91
IO109  (via drill 0.2)
  sig2 0.089: IC1.G17 81.05,91.55 82.73,91.55 82.78,91.5 88.5,91.5
  sig4 0.089: 88.5,91.5 83.78,91.5 83.73,91.55 81.05,91.55 IC1.G17
  other vias: 80.5,91
IO110  (via drill 0.2)
  sig4 0.089: IC1.G18 81.97,91 82.35,91.37 83.65,91.37 84.03,91 88.5,91
  other vias: 81.5,91
IO111
  top 0.089: IC1.H1 61.5,90
IO112
  top 0.089: IC1.H2 65,90.5 61.5,90.5
IO113  (via drill 0.2)
  sig2 0.089: IC1.H5 68.03,90 67.65,89.63 66.35,89.63 65.97,90 61.5,90
  other vias: 68.5,90
IO114  (via drill 0.2)
  sig2 0.089: IC1.H6 69.03,90 68.65,90.37 66.35,90.37 66.15,90.18 61.82,90.18 61.5,90.5
  other vias: 69.5,90
IO115  (via drill 0.2)
  sig4 0.089: IC1.H7 70.03,90 69.65,89.63 66.35,89.63 65.97,90 61.5,90
  other vias: 70.5,90
IO116  (via drill 0.2)
  sig4 0.089: IC1.H8 71.03,90 70.65,90.37 62.13,90.37 62,90.5 61.5,90.5
  other vias: 71.5,90
IO117  (via drill 0.2)
  sig4 0.089: IC1.H10 74.13,90.63 74.65,90.63 75,90.97 75,100
  other vias: 73.5,90
IO118  (via drill 0.2)
  sig5 0.089: IC1.H11 75,90.5 75,100
  other vias: 74.5,90
IO119  (via drill 0.2)
  sig4 0.089: IC1.H14 77.97,90 78.35,90.37 79.6,90.37 80.35,89.63 88.37,89.63 88.5,89.5
  other vias: 77.5,90
IO120  (via drill 0.2)
  sig5 0.089: IC1.H15 78.5,90.47 78.13,90.85 78.13,95.15 78.5,95.53 78.5,100
  other vias: 78.5,90
IO121
  top 0.089: IC1.H16 80,89.5 88.5,89.5
IO122  (via drill 0.2)
  sig4 0.089: IC1.H17 81,90.5 88.5,90.5
  other vias: 80.5,90
IO123  (via drill 0.2)
  sig2 0.089: 88.5,90.5 83.78,90.5 83.73,90.55 82.05,90.55 IC1.H18
  other vias: 81.5,90
IO124  (via drill 0.2)
  sig2 0.089: IC1.H19 82.97,90 83.35,90.37 83.65,90.37 83.85,90.18 88.5,90.18
  other vias: 82.5,90
IO125  (via drill 0.2)
  sig2 0.089: IC1.H20 88.5,90
  other vias: 83.5,90
IO126
  top 0.089: IC1.H21 85,90.5 88.5,90.5
IO127
  top 0.089: IC1.H22 88.5,90
IO128
  top 0.089: IC1.J1 61.5,89
IO129
  top 0.089: IC1.J2 65,89.5 61.5,89.5
IO130  (via drill 0.2)
  sig2 0.089: IC1.J3 61.5,89
  other vias: 66.5,89
IO131  (via drill 0.2)
  sig2 0.089: IC1.J4 67.03,89 66.65,88.63 61.63,88.63 61.5,88.5
  other vias: 67.5,89
IO132  (via drill 0.2)
  sig2 0.089: IC1.J5 68.03,89 67.65,89.37 66.35,89.37 66.15,89.18 61.82,89.18 61.5,89.5
  other vias: 68.5,89
IO133  (via drill 0.2)
  sig2 0.089: IC1.J6 68.95,88.45 61.7,88.45 61.57,88.32 60.82,88.32 60.5,88
  other vias: 69.5,89
IO134  (via drill 0.2)
  sig4 0.089: IC1.J7 70.03,89 69.65,88.63 66.35,88.63 65.97,89 61.5,89
  other vias: 70.5,89
IO135  (via drill 0.2)
  sig4 0.089: IC1.J8 71.03,89 70.65,89.37 61.63,89.37 61.5,89.5
  other vias: 71.5,89
IO136  (via drill 0.2)
  sig2 0.089: 88.5,89.5 83.78,89.5 83.73,89.55 81.05,89.55 IC1.J17
  other vias: 80.5,89
IO137  (via drill 0.2)
  sig2 0.089: IC1.J18 81.97,89 82.35,89.37 83.65,89.37 84.03,89 88.5,89
  other vias: 81.5,89
IO138
  top 0.089: IC1.J21 85,88.5 88.5,88.5
IO139
  top 0.089: IC1.J22 88.5,89
IO141  (via drill 0.2)
  sig4 0.089: 61.5,87.5 66.22,87.5 66.27,87.45 69.95,87.45 IC1.K7
  other vias: 70.5,88
IO142  (via drill 0.2)
  sig4 0.089: IC1.K8 71.03,88 70.65,88.37 61.63,88.37 61.5,88.5
  other vias: 71.5,88
IO143  (via drill 0.2)
  sig4 0.089: IC1.K17 80.87,88.37 88.37,88.37 88.5,88.5
  other vias: 80.5,88
IO144  (via drill 0.2)
  sig2 0.089: 88.5,88.5 83.78,88.5 83.73,88.55 82.05,88.55 IC1.K18
  other vias: 81.5,88
IO145  (via drill 0.2)
  sig2 0.089: IC1.K19 82.97,88 83.35,88.37 83.65,88.37 83.85,88.18 88.5,88.18
  other vias: 82.5,88
IO146
  top 0.089: IC1.K21 85,87.5 88.5,87.5
IO147
  top 0.089: IC1.K22 88.5,88
IO148  (via drill 0.2)
  sig4 0.089: IC1.L6 69.03,87 68.65,86.63 66.35,86.63 65.97,87 61.5,87
  other vias: 69.5,87
IO149  (via drill 0.2)
  sig4 0.089: IC1.L7 70.03,87 69.48,86.45 66.27,86.45 66.22,86.5 61.5,86.5
  other vias: 70.5,87
IO150  (via drill 0.2)
  sig5 0.089: IC1.L8 71,86.5 61.5,86.5
  other vias: 71.5,87
IO151
  top 0.089: IC1.L21 85,86.5 88.5,86.5
IO152
  top 0.089: IC1.L22 88.5,87
IO153
  top 0.089: IC1.M1 61.5,86
IO154
  top 0.089: IC1.M2 65,86.5 61.5,86.5
IO155  (via drill 0.2)
  sig2 0.089: IC1.M3 61.5,86
  other vias: 66.5,86
IO156  (via drill 0.2)
  sig2 0.089: IC1.M4 67.03,86 66.65,85.63 61.63,85.63 61.5,85.5
  other vias: 67.5,86
IO157  (via drill 0.2)
  sig2 0.089: IC1.M5 68.03,86 67.65,86.37 61.63,86.37 61.5,86.5
  other vias: 68.5,86
IO158  (via drill 0.2)
  sig4 0.089: IC1.M6 69.03,86 68.65,85.63 66.35,85.63 65.97,86 61.5,86
  other vias: 69.5,86
IO159  (via drill 0.2)
  sig4 0.089: 61.5,85.5 66.22,85.5 66.27,85.45 69.95,85.45 IC1.M7
  other vias: 70.5,86
IO160  (via drill 0.2)
  sig5 0.089: IC1.M8 71,85.5 61.5,85.5
  other vias: 71.5,86
IO161  (via drill 0.2)
  sig4 0.089: 88.5,86.5 83.78,86.5 83.73,86.55 80.05,86.55 IC1.M16
  other vias: 79.5,86
IO162  (via drill 0.2)
  sig2 0.089: 88.5,86.18 83.85,86.18 83.65,86.37 83.35,86.37 82.97,86 IC1.M19
  other vias: 82.5,86
IO163  (via drill 0.2)
  sig2 0.089: IC1.M20 88.5,86
  other vias: 83.5,86
IO164
  top 0.089: IC1.M21 85,85.5 88.5,85.5
IO165
  top 0.089: IC1.M22 88.5,86
IO166
  top 0.089: IC1.N1 61.5,85
IO167
  top 0.089: IC1.N2 65,85.5 61.5,85.5
IO168  (via drill 0.2)
  sig2 0.089: IC1.N5 68.03,85 67.65,84.63 66.35,84.63 65.97,85 61.5,85
  other vias: 68.5,85
IO169  (via drill 0.2)
  sig4 0.089: IC1.N6 69.03,85 68.65,84.63 66.35,84.63 65.97,85 61.5,85
  other vias: 69.5,85
IO170  (via drill 0.2)
  sig4 0.089: 61.5,84.5 66.22,84.5 66.27,84.45 69.95,84.45 IC1.N7
  other vias: 70.5,85
IO171  (via drill 0.2)
  sig5 0.089: IC1.N8 71,84.5 61.5,84.5
  other vias: 71.5,85
IO172  (via drill 0.2)
  sig4 0.089: 88.5,85.5 83.78,85.5 83.73,85.55 80.05,85.55 IC1.N16
  other vias: 79.5,85
IO173  (via drill 0.2)
  sig4 0.089: IC1.N17 80.97,85 81.35,85.37 83.65,85.37 84.03,85 88.5,85
  other vias: 80.5,85
IO174  (via drill 0.2)
  sig2 0.089: 88.5,85.5 83.78,85.5 83.73,85.55 82.05,85.55 IC1.N18
  other vias: 81.5,85
IO175  (via drill 0.2)
  sig2 0.089: 88.5,85.18 83.85,85.18 83.65,85.37 83.35,85.37 82.97,85 IC1.N19
  other vias: 82.5,85
IO176  (via drill 0.2)
  sig2 0.089: IC1.N20 88.5,85
  other vias: 83.5,85
IO177
  top 0.089: IC1.N21 85,84.5 88.5,84.5
IO178
  top 0.089: IC1.N22 88.5,85
IO179
  top 0.089: IC1.P1 61.5,84
IO180
  top 0.089: IC1.P2 65,84.5 61.5,84.5
IO181  (via drill 0.2)
  sig2 0.089: IC1.P3 61.5,84
  other vias: 66.5,84
IO182  (via drill 0.2)
  sig2 0.089: IC1.P4 67.03,84 66.65,83.63 62.13,83.63 62,83.5 61.5,83.5
  other vias: 67.5,84
IO183  (via drill 0.2)
  sig2 0.089: IC1.P5 68.03,84 67.65,84.37 61.63,84.37 61.5,84.5
  other vias: 68.5,84
IO184  (via drill 0.2)
  sig4 0.089: IC1.P6 69.03,84 68.65,83.63 66.35,83.63 65.97,84 61.5,84
  other vias: 69.5,84
IO185  (via drill 0.2)
  sig4 0.089: 61.5,83.5 66.22,83.5 66.27,83.45 69.95,83.45 IC1.P7
  other vias: 70.5,84
IO186  (via drill 0.2)
  sig4 0.089: IC1.P15 78.97,84 79.35,84.37 83.65,84.37 84.03,84 88.5,84
  other vias: 78.5,84
IO187  (via drill 0.2)
  sig2 0.089: 88.5,84.5 83.78,84.5 83.73,84.55 80.05,84.55 IC1.P16
  other vias: 79.5,84
IO188  (via drill 0.2)
  sig2 0.089: 88.5,84.18 83.85,84.18 83.65,84.37 81.35,84.37 80.97,84 IC1.P17
  other vias: 80.5,84
IO189  (via drill 0.2)
  sig2 0.089: IC1.P20 88.5,84
  other vias: 83.5,84
IO190
  top 0.089: IC1.P21 85,83.5 88.5,83.5
IO191
  top 0.089: IC1.P22 88.5,84
IO192
  top 0.089: IC1.R1 61.5,83
IO193
  top 0.089: IC1.R2 65,83.5 61.5,83.5
IO194  (via drill 0.2)
  sig2 0.089: IC1.R5 68.03,83 67.65,82.63 66.35,82.63 65.97,83 61.5,83
  other vias: 68.5,83
IO195  (via drill 0.2)
  sig4 0.089: IC1.R6 69.03,83 68.65,82.63 66.35,82.63 65.97,83 61.5,83
  other vias: 69.5,83
IO196  (via drill 0.2)
  sig4 0.089: 61.5,82.5 66.22,82.5 66.27,82.45 69.95,82.45 IC1.R7
  other vias: 70.5,83
IO197  (via drill 0.2)
  sig4 0.089: 88.5,82 88.05,82.45 78.52,82.45 77.97,83 IC1.R14
  other vias: 77.5,83
IO198  (via drill 0.2)
  sig4 0.089: IC1.R15 78.97,83 79.35,82.63 88.37,82.63 88.5,82.5
  other vias: 78.5,83
IO199  (via drill 0.2)
  sig4 0.089: IC1.R16 80.05,83.55 83.73,83.55 83.78,83.5 88.5,83.5
  other vias: 79.5,83
IO200  (via drill 0.2)
  sig4 0.089: IC1.R17 80.97,83 81.35,83.37 83.65,83.37 84.03,83 88.5,83
  other vias: 80.5,83
IO201  (via drill 0.2)
  sig2 0.089: 88.5,83.5 83.78,83.5 83.73,83.55 82.05,83.55 IC1.R18
  other vias: 81.5,83
IO202  (via drill 0.2)
  sig2 0.089: 88.5,83.18 83.85,83.18 83.65,83.37 83.35,83.37 82.97,83 IC1.R19
  other vias: 82.5,83
IO203  (via drill 0.2)
  sig2 0.089: IC1.R20 88.5,83
  other vias: 83.5,83
IO204
  top 0.089: IC1.R21 85,82.5 88.5,82.5
IO205
  top 0.089: IC1.R22 88.5,83
IO206  (via drill 0.2)
  sig2 0.089: IC1.T3 61.5,82
  other vias: 66.5,82
IO207  (via drill 0.2)
  sig2 0.089: IC1.T4 67.03,82 66.65,81.63 61.63,81.63 61.5,81.5
  other vias: 67.5,82
IO208  (via drill 0.2)
  sig2 0.089: IC1.T5 67.95,81.45 61.95,81.45 61.5,81
  other vias: 68.5,82
IO209  (via drill 0.2)
  sig4 0.089: IC1.T7 70.03,82 69.65,81.63 66.35,81.63 65.97,82 61.5,82
  other vias: 70.5,82
IO210  (via drill 0.2)
  sig4 0.089: 61.5,81.5 66.22,81.5 66.27,81.45 70.95,81.45 IC1.T8
  other vias: 71.5,82
IO211  (via drill 0.2)
  sig4 0.089: IC1.T9 72.5,81.53 72.87,81.15 72.87,77.85 72.5,77.47 72.5,73
  other vias: 72.5,82
IO212  (via drill 0.2)
  sig4 0.089: IC1.T10 73.5,81.53 73.87,81.15 73.87,77.85 73.5,77.47 73.5,73
  other vias: 73.5,82
IO213  (via drill 0.2)
  sig4 0.089: IC1.T11 74.5,81.53 74.87,81.15 74.87,77.85 74.5,77.47 74.5,73
  other vias: 74.5,82
IO214  (via drill 0.2)
  sig4 0.089: IC1.T12 75.5,81.53 75.87,81.15 75.87,77.85 75.5,77.47 75.5,73
  other vias: 75.5,82
IO215  (via drill 0.2)
  sig4 0.089: IC1.T13 76.5,81.53 76.87,81.15 76.87,77.85 76.5,77.47 76.5,73
  other vias: 76.5,82
IO216  (via drill 0.2)
  sig4 0.089: IC1.T14 77.5,81.53 77.87,81.15 77.87,77.85 77.5,77.47 77.5,73
  other vias: 77.5,82
IO217  (via drill 0.2)
  sig4 0.089: IC1.T15 78.5,81.53 78.87,81.15 78.87,78.85 78.5,78.47 78.5,73
  other vias: 78.5,82
IO218  (via drill 0.2)
  sig4 0.089: IC1.T16 79.5,81.53 79.87,81.15 79.87,78.85 79.83,78.8 79.95,78.69 79.95,73.05 80,73
  other vias: 79.5,82
IO219  (via drill 0.2)
  sig2 0.089: 88.5,82.5 83.78,82.5 83.73,82.55 81.05,82.55 IC1.T17
  other vias: 80.5,82
IO220  (via drill 0.2)
  sig2 0.089: IC1.T18 81.97,82 82.35,82.37 83.65,82.37 84.03,82 88.5,82
  other vias: 81.5,82
IO221
  top 0.089: IC1.U1 61.5,81
IO222
  top 0.089: IC1.U2 65,81.5 61.5,81.5
IO223  (via drill 0.2)
  sig4 0.089: IC1.U7 70.03,81 69.65,80.63 66.35,80.63 65.97,81 61.5,81
  other vias: 70.5,81
IO224  (via drill 0.2)
  sig4 0.089: IC1.U8 71.03,81 70.48,80.45 66.27,80.45 66.22,80.5 61.5,80.5
  other vias: 71.5,81
IO225  (via drill 0.2)
  sig2 0.089: 73,73 73,77.72 72.95,77.77 72.95,80.55 IC1.U9
  other vias: 72.5,81
IO226  (via drill 0.2)
  other vias: 73.5,81
IO227  (via drill 0.2)
  sig2 0.089: IC1.U11 74.5,80.53 73.95,79.98 73.95,77.77 74,77.72 74,73
  other vias: 74.5,81
IO228  (via drill 0.2)
  sig2 0.089: IC1.U12 75.5,80.53 74.95,79.98 74.95,77.77 75,77.72 75,73
  other vias: 75.5,81
IO229  (via drill 0.2)
  sig2 0.089: 75.75,73.02 75.95,73.22 75.95,79.98 76.5,80.53 IC1.U13
  other vias: 76.5,81
IO230  (via drill 0.2)
  sig2 0.089: 78,73 78,77.72 78.05,77.77 78.05,80.45 IC1.U14
  other vias: 77.5,81
IO231  (via drill 0.2)
  sig2 0.089: 79,73 79,78.72 79.05,78.77 79.05,80.45 IC1.U15
  other vias: 78.5,81
IO232  (via drill 0.2)
  sig2 0.089: 80,73 80,78.72 80.05,78.77 80.05,80.45 IC1.U16
  other vias: 79.5,81
IO233  (via drill 0.2)
  sig2 0.089: 88.5,81.5 83.78,81.5 83.73,81.55 81.05,81.55 IC1.U17
  other vias: 80.5,81
IO234  (via drill 0.2)
  sig2 0.089: 88.5,81.18 83.85,81.18 83.65,81.37 83.35,81.37 82.97,81 IC1.U19
  other vias: 82.5,81
IO235  (via drill 0.2)
  sig2 0.089: IC1.U20 88.5,81
  other vias: 83.5,81
IO236
  top 0.089: IC1.U21 85,80.5 88.5,80.5
IO237
  top 0.089: IC1.U22 88.5,81
IO238
  top 0.089: IC1.V1 61.5,80
IO239
  top 0.089: IC1.V2 65,80.5 61.5,80.5
IO240  (via drill 0.2)
  sig2 0.089: IC1.V3 61.5,80
  other vias: 66.5,80
IO241  (via drill 0.2)
  sig2 0.089: IC1.V4 67.03,80 66.65,79.63 61.63,79.63 61.5,79.5
  other vias: 67.5,80
IO242  (via drill 0.2)
  sig2 0.089: IC1.V5 67.95,79.45 61.95,79.45 61.5,79
  other vias: 68.5,80
IO243  (via drill 0.2)
  sig2 0.089: 68.82,73 68.82,73.07 68.95,73.2 68.95,78.98 69.5,79.53 IC1.V6
  other vias: 69.5,80
IO244  (via drill 0.2)
  sig2 0.089: IC1.V7 70.5,79.53 70.87,79.15 70.87,73.13 71,73
  other vias: 70.5,80
IO245  (via drill 0.2)
  sig2 0.089: IC1.V8 71.5,79.53 71.87,79.15 71.87,73.13 72,73
  other vias: 71.5,80
IO246  (via drill 0.2)
  sig2 0.089: IC1.V9 72.5,79.53 72.13,79.15 72.13,78.85 72.22,78.75 72.22,78.25 72.13,78.15 72.13,73.37 72.5,73
  other vias: 72.5,80
IO247  (via drill 0.2)
  other vias: 73.5,80
IO248  (via drill 0.2)
  sig2 0.089: IC1.V11 74.5,79.53 74.13,79.15 74.13,77.85 74.5,77.47 74.5,73
  other vias: 74.5,80
IO249  (via drill 0.2)
  sig2 0.089: IC1.V12 75.5,79.53 75.13,79.15 75.13,77.85 75.5,77.47 75.5,73
  other vias: 75.5,80
IO250  (via drill 0.2)
  sig2 0.089: IC1.V13 76.5,79.53 76.13,79.15 76.13,73.13 76,73
  other vias: 76.5,80
IO251  (via drill 0.2)
  sig2 0.089: IC1.V14 77.5,79.53 77.13,79.15 77.13,77.85 77.32,77.65 77.32,73
  other vias: 77.5,80
IO252  (via drill 0.2)
  sig2 0.089: IC1.V15 78.87,79.63 78.87,78.85 78.68,78.65 78.68,73.06 78.73,73.01
  other vias: 78.5,80
IO253  (via drill 0.2)
  sig5 0.089: IC1.V16 80,79.5 80,73
  other vias: 79.5,80
IO254
  top 0.089: IC1.V21 85,79.5 88.5,79.5
IO255
  top 0.089: IC1.V22 88.5,80
IO256
  top 0.089: IC1.W1 61.5,79
IO257
  top 0.089: IC1.W2 65,79.5 61.5,79.5
IO258  (via drill 0.2)
  sig2 0.089: IC1.W6 69.5,78.53 69.13,78.15 69.13,73.13 69,73
  other vias: 69.5,79
IO259  (via drill 0.2)
  sig2 0.089: IC1.W7 70.5,78.53 70.13,78.15 70.13,73.13 70,73
  other vias: 70.5,79
IO260  (via drill 0.2)
  sig2 0.089: 71.32,73 71.32,77.65 71.13,77.85 71.13,78.15 71.5,78.53 IC1.W8
  other vias: 71.5,79
IO261  (via drill 0.2)
  sig2 0.089: 73.32,73 73.32,77.65 73.13,77.85 73.13,78.15 73.5,78.53 IC1.W10
  other vias: 73.5,79
IO262  (via drill 0.2)
  sig2 0.089: IC1.W13 76.95,78.55 76.95,77.77 77,77.72 77,73
  other vias: 76.5,79
IO263  (via drill 0.2)
  sig2 0.089: IC1.W14 77.5,78.53 77.87,78.15 77.87,77.85 77.5,77.47 77.5,73
  other vias: 77.5,79
IO264  (via drill 0.2)
  sig2 0.089: IC1.W15 78.5,73
  other vias: 78.5,79
IO265  (via drill 0.2)
  sig2 0.089: IC1.W17 81,78.5 81,73
  other vias: 80.5,79
IO266  (via drill 0.2)
  sig2 0.089: IC1.W19 82.5,78.53 82.87,78.15 82.87,77.85 82.5,77.47 82.5,73
  other vias: 82.5,79
IO267  (via drill 0.2)
  sig2 0.089: IC1.W20 83.5,78.53 83.87,78.15 83.87,77.85 83.5,77.47 83.5,73
  other vias: 83.5,79
IO268
  top 0.089: IC1.W21 85,78.5 88.5,78.5
IO269
  top 0.089: IC1.W22 88.5,79
IO270
  top 0.089: IC1.Y1 61.5,78
IO271
  top 0.089: IC1.Y2 65,78.5 61.5,78.5
IO272  (via drill 0.2)
  sig2 0.089: IC1.Y3 61.5,78
  other vias: 66.5,78
IO273  (via drill 0.2)
  sig2 0.089: IC1.Y4 67.03,78 66.65,78.37 66.35,78.37 66.15,78.18 61.82,78.18 61.5,78.5
  other vias: 67.5,78
IO274  (via drill 0.2)
  sig2 0.089: IC1.Y6 69.5,77.53 69.87,77.15 69.87,76.85 69.5,76.47 69.5,73
  other vias: 69.5,78
IO275  (via drill 0.2)
  sig2 0.089: IC1.Y7 70.5,73
  other vias: 70.5,78
IO276  (via drill 0.2)
  sig2 0.089: IC1.Y8 71.5,73
  other vias: 71.5,78
IO277  (via drill 0.2)
  sig2 0.089: IC1.Y10 73.5,73
  other vias: 73.5,78
IO278  (via drill 0.2)
  sig2 0.089: IC1.Y13 76.5,73
  other vias: 76.5,78
IO279  (via drill 0.2)
  sig2 0.089: IC1.Y17 80.5,73
  other vias: 80.5,78
IO280
  top 0.089: IC1.Y21 85,77.5 88.5,77.5
IO281
  top 0.089: IC1.Y22 88.5,78
IO282
  top 0.089: IC1.AA1 61.5,77
IO283
  top 0.089: IC1.AA3 66,76.5 66,73
IO284
  top 0.089: IC1.AA4 67,76.5 67,73
IO285
  top 0.089: IC1.AA5 68,76.5 68,73
IO286
  top 0.089: IC1.AA7 70,76.5 70,73
IO287
  top 0.089: IC1.AA8 71,76.5 71,73
IO288
  top 0.089: IC1.AA9 72,76.5 72,73
IO289
  top 0.089: IC1.AA10 73,76.5 73,73
IO290
  top 0.089: IC1.AA13 76,76.5 76,73
IO291
  top 0.089: IC1.AA14 77,76.5 77,73
IO292
  top 0.089: IC1.AA15 78,76.5 78,73
IO293
  top 0.089: IC1.AA16 79,76.5 79,73
IO294
  top 0.089: IC1.AA17 80,76.5 80,73
IO295
  top 0.089: IC1.AA18 81,76.5 81,73
IO296
  top 0.089: IC1.AA19 82,76.5 82,73
IO297
  top 0.089: IC1.AA20 83,76.5 83,73
IO298
  top 0.089: IC1.AA21 84,76.5 84,73
IO299
  top 0.089: IC1.AB3 66.5,73
IO300
  top 0.089: IC1.AB4 67.5,73
IO301
  top 0.089: IC1.AB5 68.5,73
IO302
  top 0.089: IC1.AB7 70.5,73
IO303
  top 0.089: IC1.AB8 71.5,73
IO304
  top 0.089: IC1.AB9 72.5,73
IO305
  top 0.089: IC1.AB10 73.5,73
IO306
  top 0.089: IC1.AB13 76.5,73
IO307
  top 0.089: IC1.AB14 77.5,73
IO308
  top 0.089: IC1.AB15 78.5,73
IO309
  top 0.089: IC1.AB16 79.5,73
IO310
  top 0.089: IC1.AB17 80.5,73
IO311
  top 0.089: IC1.AB18 81.5,73
IO312
  top 0.089: IC1.AB19 82.5,73
IO313
  top 0.089: IC1.AB20 83.5,73
MSEL0  (via drill 0.2)  (1 unrouted)
  sig4 0.089: IC1.M17 80.97,86 81.35,86.37 83.65,86.37 84.03,86 88.5,86
  other vias: 80.5,86
MSEL1  (via drill 0.2)  (1 unrouted)
  sig2 0.089: IC1.L18 82,87.5 88.5,87.5
  other vias: 81.5,87
MSEL2  (via drill 0.2)  (1 unrouted)
  sig4 0.089: IC1.L17 81,87.5 88.5,87.5
  other vias: 80.5,87
MSEL3  (via drill 0.2)  (1 unrouted)
  sig2 0.089: IC1.K20 88.5,88
  other vias: 83.5,88
N$33  (1 unrouted)
N$34  (1 unrouted)
N$35  (1 unrouted)
N$36  (1 unrouted)
N$37  (1 unrouted)
N$38  (1 unrouted)
N$39  (1 unrouted)
N$40
  top 0.406: R38.P$2 LED40.A
NCE  (via drill 0.2)  (1 unrouted)
  sig2 0.089: IC1.L3 61.5,87
  other vias: 66.5,87
NCONFIG  (via drill 0.2)  (2 unrouted)
  sig2 0.089: IC1.K5 68.03,88 67.65,87.63 66.35,87.63 65.97,88 61.5,88
  other vias: 68.5,88
NCSO  (1 unrouted)
  top 0.089: IC1.E2 65,93.5 61.5,93.5
NSTATUS  (via drill 0.2)  (1 unrouted)
  sig4 0.089: IC1.K6 69.03,88 68.65,87.63 66.35,87.63 65.97,88 61.5,88
  other vias: 69.5,88
TCK  (1 unrouted)
  top 0.089: IC1.L2 65,87.5 61.5,87.5
TDI  (via drill 0.2)  (1 unrouted)
  sig2 0.089: IC1.L5 68.03,87 67.58,86.55 61.7,86.55 61.57,86.68 60.82,86.68 60.5,87
  other vias: 68.5,87
TDO  (via drill 0.2)  (1 unrouted)
  sig2 0.089: IC1.L4 67.03,87 66.65,87.37 61.63,87.37 61.5,87.5
  other vias: 67.5,87
TMS  (1 unrouted)
  top 0.089: IC1.L1 61.5,87
VCCA  (via drill 0.2)  (1 unrouted)
  top 0.406: R20.P$2 v123.5,127.5
  pow1 0.305: IC1.U18 81,81.5 70,81.5 IC1.T6 70,82.5 70,90.5 IC1.G6 70.02,91.52 80.7,91.52 81.18,92 IC1.F18 81.5,92.32 81.02,92.8 81.02,102.98 81,103
  pow1 0.406: v123.5,127.5 109,127.5 84.48,102.98 81.02,102.98
  other vias: 81.5,81 81.5,92 69.5,91 69.5,82
VCCINT  (via drill 0.2)  (1 unrouted)
  top 0.152: IC1.P9 IC1.N9 IC1.M9 IC1.L9 IC1.K9 IC1.J10 | IC1.P9 IC1.R8 | IC1.P9 IC1.P10 | IC1.P10 IC1.R10 | IC1.P10 IC1.P11 IC1.P12 | IC1.P12 IC1.R12 | IC1.P12 IC1.P13 IC1.P14 IC1.N14 | IC1.N14 IC1.M15 IC1.L16 | IC1.J16 IC1.K15 IC1.L14 | IC1.L14 IC1.M14 IC1.N14 | IC1.L14 IC1.K14 IC1.J14 IC1.J13 IC1.J12 IC1.J11 IC1.J10 | IC1.J10 IC1.H9
  top 0.406: R18.P$2 104,128.5 v83.5,108
  pow1 0.406: IC1.G12 IC1.J12
  pow2 0.254: v83.5,108 83.5,95.64 82.95,95.1 82.95,94.81 82.6,94.45 82.31,94.45 81.95,94.1 81.95,93.81 81.6,93.45 81.31,93.45 80.95,93.1 80.95,92.81 80.69,92.55 80.55,92.55 80.45,92.45 80.31,92.45 79.95,92.1 79.95,90.81 79.5,90.36 IC1.J16
  other vias: 73.5,89 77.5,89 78.5,88 79.5,89 77.5,84 72.5,84 75.5,91 75.5,89
  pour pow1 (isolate 0.61): -1.5,140 158.5,140 152.5,-3.5 -1.5,-3.5
VCCIO  (via drill 0.2)  (8 unrouted)
  top 0.406: R17.P$2 v123.5,130.5
  other vias: 65.5,97 67.5,94 67.5,92 67.5,90 67.5,88 67.5,85 67.5,83 67.5,81 67.5,79 72.5,79 75.5,79 79.5,79 81.5,79 82.5,80 82.5,82 81.5,84 82.5,87 83.5,89 82.5,91 82.5,93 68.5,94 71.5,93 75.5,94 77.5,94 79.5,94 84.5,97 81.5,94 65.5,76 68.5,79 69.5,77 84.5,76 82.5,78 74.5,79 77.5,78 74.5,94 72.5,94
  pour pow2: -0.5,138.5 -0.5,-1.5 156,-1.5 156,-1.5 156,139 0.5,139 0,138.5
VCCPLL  (via drill 0.2)  (1 unrouted)
  top 0.406: R19.P$2 v107.31,130.81
  pow1 0.305: 80.5,101.5 80.5,95.68 80.02,95.2 80.02,93.8 80.5,93.32 IC1.E17 80,92.5 70,92.5 IC1.F6 69,91.5 69,81.5 IC1.U6 70,80.5 80,80.5 IC1.V17
  pow1 0.406: v107.31,130.81 80.5,104 80.5,101.5
  other vias: 80.5,93 80.5,80 69.5,81 69.5,92

## Text on the board
tPlace: 5V | GND | 3V3 | GND | 2V5 | GND | 1V2 | GND | VCCPLL | VCCIO | Haasoscope Pro / FPGA board, v1.0 / by Dr. Andy Haas / July 2024 | IO1/RESET | VCCINT | VCCA | 1.2V | 2.5V | 3.3V | IO1 | IO2 | IO3 | IO4 | IO5 | IO6 | 2V5 | 3V3 | NCONFIG